# EAGLE design Control module (EAGLE 9.0.1)

## Sheet 1 of 6: Microcontroller
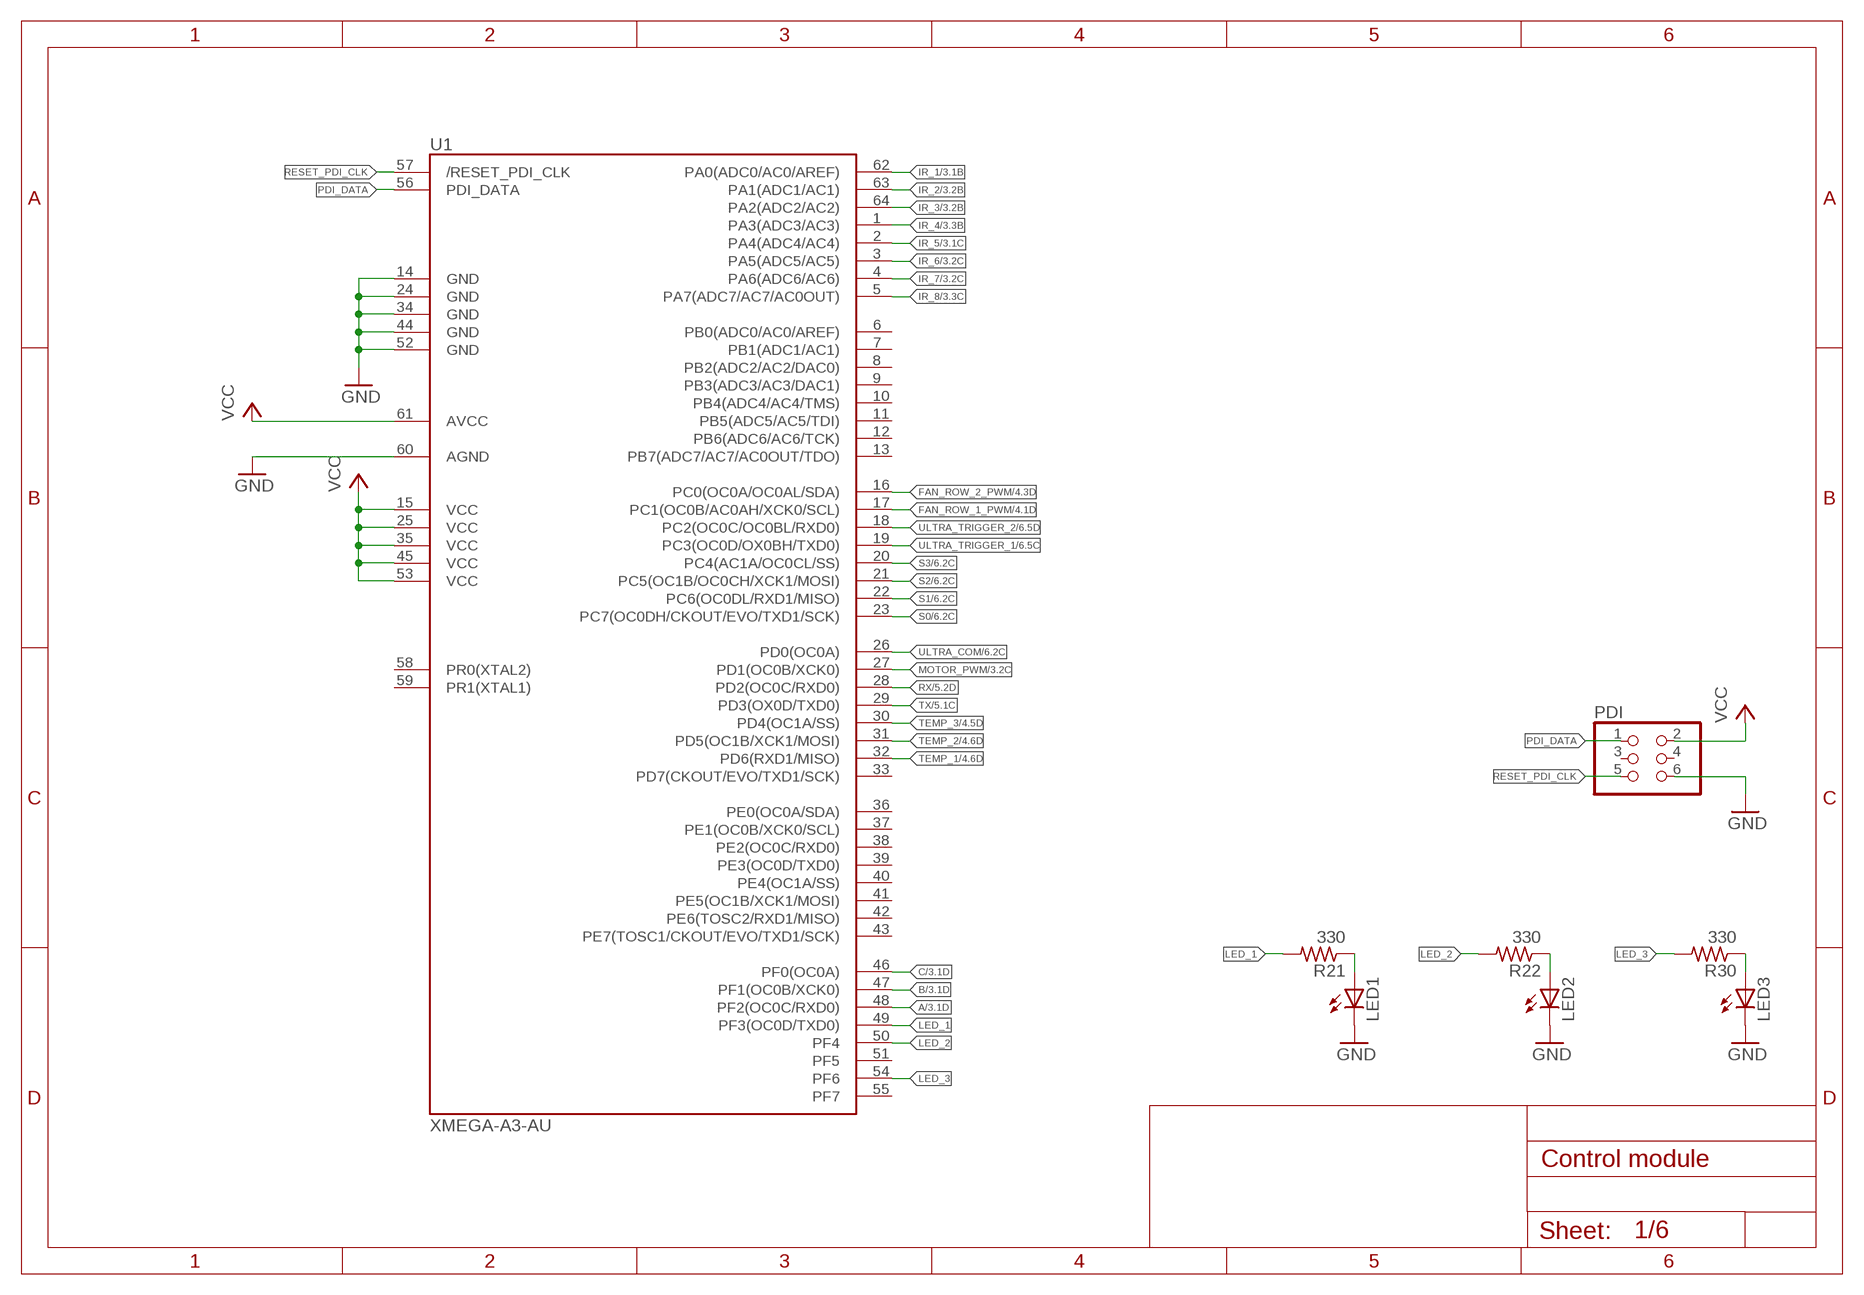
[diagram p0: schematic, sheet 1]

### Parts
LED1  LEDCHIPLED_0805  [CHIPLED_0805]
LED2  LEDCHIPLED_0805  [CHIPLED_0805]
LED3  LEDCHIPLED_0805  [CHIPLED_0805]
PDI  PINHD-2X3  [2X03]
R21  330  R-US_R0805  [R0805]
R22  330  R-US_R0805  [R0805]
R30  330  R-US_R0805  [R0805]
U1  XMEGA-A3-AU  [TQFP64_14X14MM_MCU]

### Nets
A: U1.48(PF2(OC0C/RXD0)) ; also sheet 3
B: U1.47(PF1(OC0B/XCK0)) ; also sheet 3
C: U1.46(PF0(OC0A)) ; also sheet 3
FAN_ROW_1_PWM: U1.17(PC1(OC0B/AC0AH/XCK0/SCL)) ; also sheet 4
FAN_ROW_2_PWM: U1.16(PC0(OC0A/OC0AL/SDA)) ; also sheet 4
GND: LED1.C LED2.C LED3.C PDI.6 U1.14(GND1) U1.24(GND2) U1.34(GND3) U1.44(GND4) U1.52(GND5) U1.60(AGND) ; also sheet 2,3,4,5,6
IR_1: U1.62(PA0(ADC0/AC0/AREF)) ; also sheet 3
IR_2: U1.63(PA1(ADC1/AC1)) ; also sheet 3
IR_3: U1.64(PA2(ADC2/AC2)) ; also sheet 3
IR_4: U1.1(PA3(ADC3/AC3)) ; also sheet 3
IR_5: U1.2(PA4(ADC4/AC4)) ; also sheet 3
IR_6: U1.3(PA5(ADC5/AC5)) ; also sheet 3
IR_7: U1.4(PA6(ADC6/AC6)) ; also sheet 3
IR_8: U1.5(PA7(ADC7/AC7/AC0OUT)) ; also sheet 3
LED_1: R21.2 U1.49(PF3(OC0D/TXD0))
LED_2: R22.2 U1.50(PF4)
LED_3: R30.2 U1.54(PF6)
MOTOR_PWM: U1.27(PD1(OC0B/XCK0)) ; also sheet 3
N$1: LED2.A R22.1
N$3: LED1.A R21.1
N$4: LED3.A R30.1
PDI_DATA: PDI.1 U1.56(PDI_DATA)
RESET_PDI_CLK: PDI.5 U1.57(/RESET_PDI_CLK)
RX: U1.28(PD2(OC0C/RXD0)) ; also sheet 5
S0: U1.23(PC7(OC0DH/CKOUT/EVO/TXD1/SCK)) ; also sheet 6
S1: U1.22(PC6(OC0DL/RXD1/MISO)) ; also sheet 6
S2: U1.21(PC5(OC1B/OC0CH/XCK1/MOSI)) ; also sheet 6
S3: U1.20(PC4(AC1A/OC0CL/SS)) ; also sheet 6
TEMP_1: U1.32(PD6(RXD1/MISO)) ; also sheet 4
TEMP_2: U1.31(PD5(OC1B/XCK1/MOSI)) ; also sheet 4
TEMP_3: U1.30(PD4(OC1A/SS)) ; also sheet 4
TX: U1.29(PD3(OX0D/TXD0)) ; also sheet 5
ULTRA_COM: U1.26(PD0(OC0A)) ; also sheet 6
ULTRA_TRIGGER_1: U1.19(PC3(OC0D/OX0BH/TXD0)) ; also sheet 6
ULTRA_TRIGGER_2: U1.18(PC2(OC0C/OC0BL/RXD0)) ; also sheet 6
VCC: PDI.2 U1.15(VCC1) U1.25(VCC2) U1.35(VCC3) U1.45(VCC4) U1.53(VCC5) U1.61(AVCC) ; also sheet 2,3,4,5,6
Unconnected: PDI.3 PDI.4 U1.6(PB0(ADC0/AC0/AREF)) U1.7(PB1(ADC1/AC1)) U1.8(PB2(ADC2/AC2/DAC0)) U1.9(PB3(ADC3/AC3/DAC1)) U1.10(PB4(ADC4/AC4/TMS)) U1.11(PB5(ADC5/AC5/TDI)) U1.12(PB6(ADC6/AC6/TCK)) U1.13(PB7(ADC7/AC7/AC0OUT/TDO)) U1.33(PD7(CKOUT/EVO/TXD1/SCK)) U1.36(PE0(OC0A/SDA)) U1.37(PE1(OC0B/XCK0/SCL)) U1.38(PE2(OC0C/RXD0)) U1.39(PE3(OC0D/TXD0)) U1.40(PE4(OC1A/SS)) U1.41(PE5(OC1B/XCK1/MOSI)) U1.42(PE6(TOSC2/RXD1/MISO)) U1.43(PE7(TOSC1/CKOUT/EVO/TXD1/SCK)) U1.51(PF5) U1.55(PF7) U1.58(PR0(XTAL2)) U1.59(PR1(XTAL1))

## Sheet 2 of 6: Voltage regulation
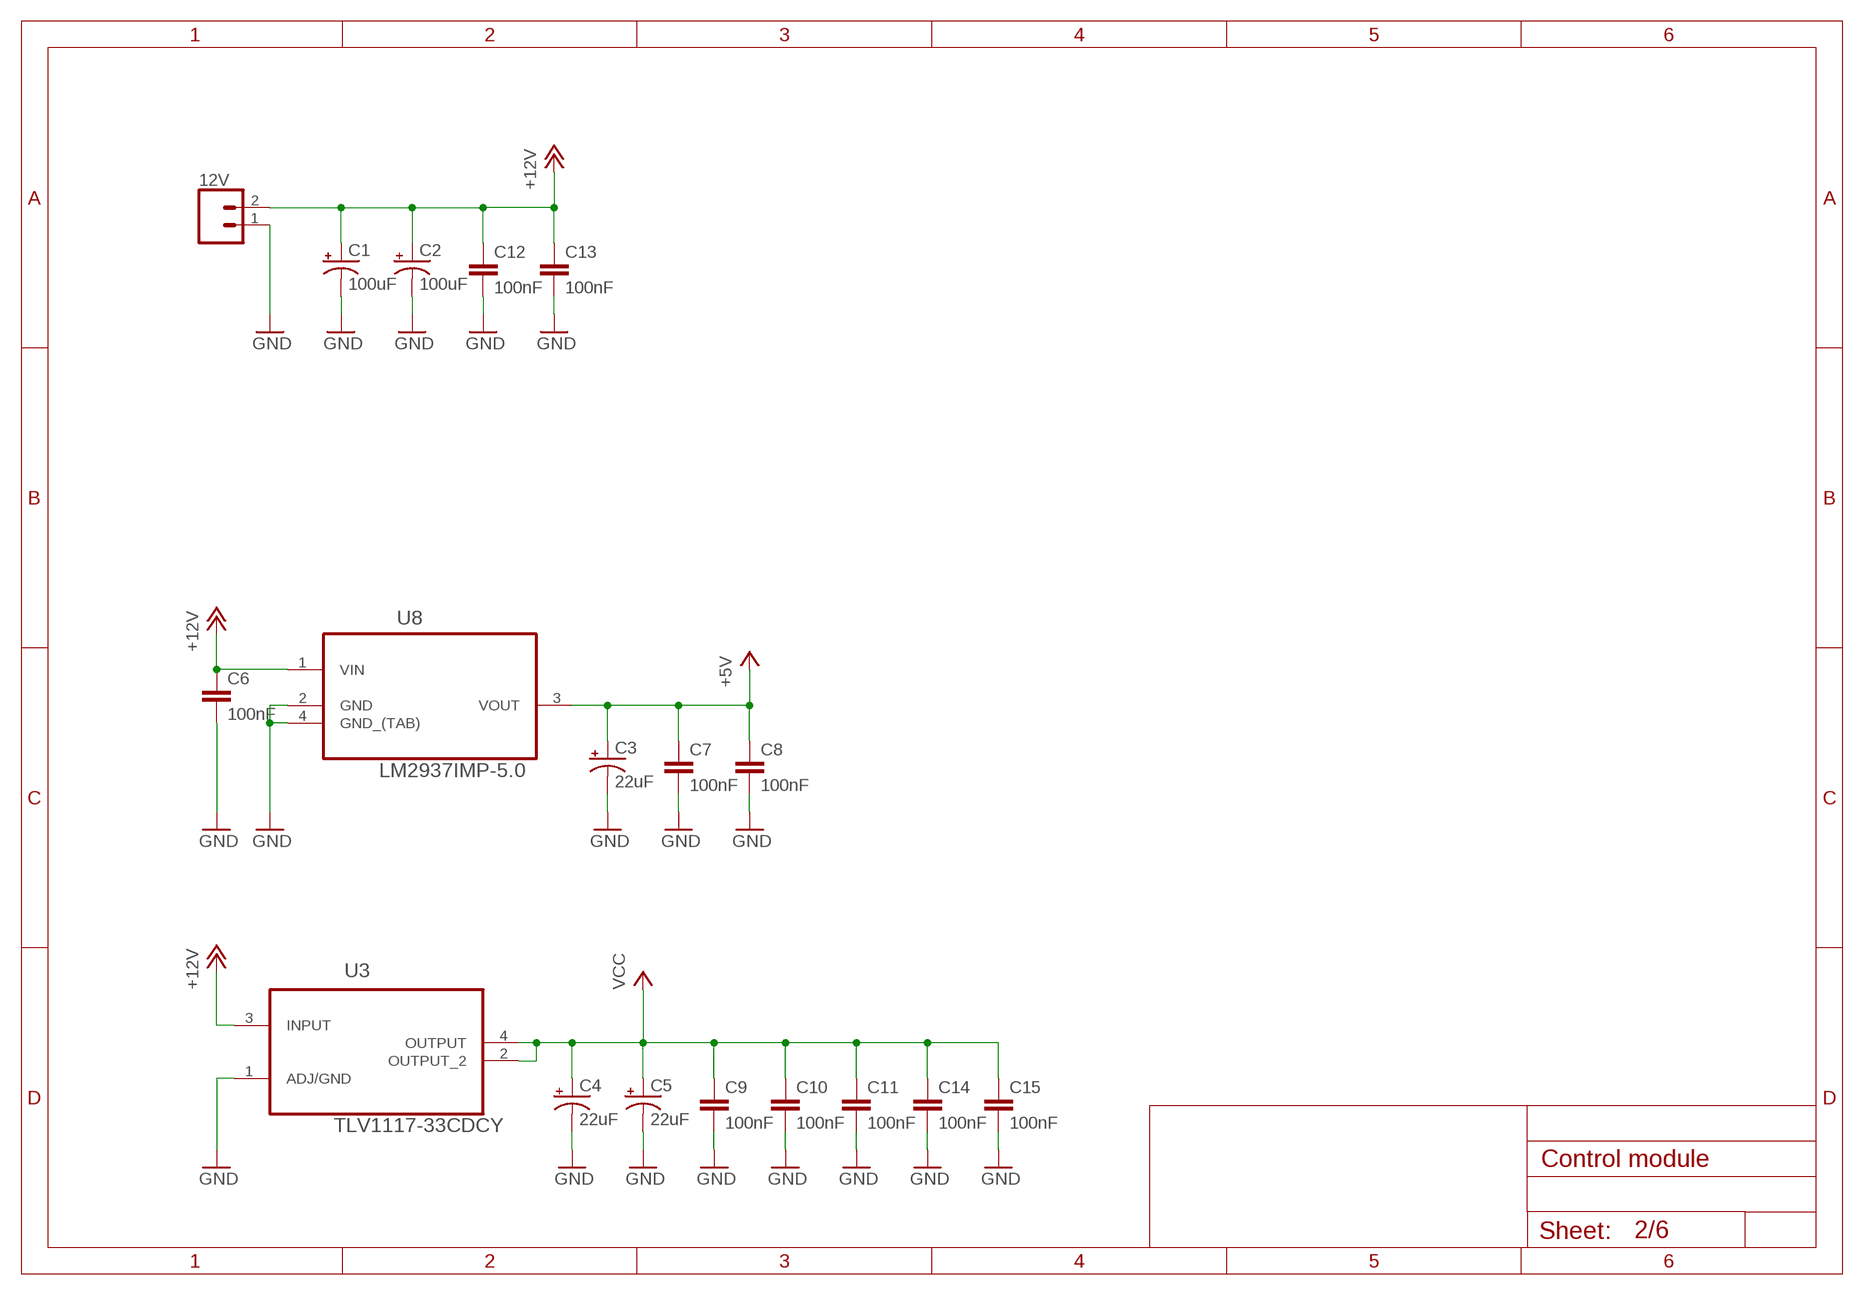
[diagram p1: schematic, sheet 2]

### Parts
12V  CONN_025MM  [SCREWTERMINAL-5MM-2]
C1  100uF  CPOL-US150CLZ-0810  [150CLZ-0810]
C2  100uF  CPOL-US150CLZ-0810  [150CLZ-0810]
C3  22uF  CPOL-US153CLV-0505  [153CLV-0505]
C4  22uF  CPOL-US153CLV-0505  [153CLV-0505]
C5  22uF  CPOL-US153CLV-0505  [153CLV-0505]
C6  100nF  1.0UF-0805-25V-(+80/-20%)  [0805]
C7  100nF  1.0UF-0805-25V-(+80/-20%)  [0805]
C8  100nF  1.0UF-0805-25V-(+80/-20%)  [0805]
C9  100nF  1.0UF-0805-25V-(+80/-20%)  [0805]
C10  100nF  1.0UF-0805-25V-(+80/-20%)  [0805]
C11  100nF  1.0UF-0805-25V-(+80/-20%)  [0805]
C12  100nF  1.0UF-0805-25V-(+80/-20%)  [0805]
C13  100nF  1.0UF-0805-25V-(+80/-20%)  [0805]
C14  100nF  1.0UF-0805-25V-(+80/-20%)  [0805]
C15  100nF  1.0UF-0805-25V-(+80/-20%)  [0805]
U3  TLV1117-33CDCY  [SOT230P700X180-4N]
U8  LM2937IMP-5.0  [SOT230P700X180-4N]

### Nets
+5V: C3.+ C7.1 C8.1 U8.3(VOUT) ; also sheet 5,6
+12V: 12V.2 C1.+ C2.+ C6.1 C12.1 C13.1 U3.3(INPUT) U8.1(VIN) ; also sheet 3,4,5
GND: 12V.1 C1.- C2.- C3.- C4.- C5.- C6.2 C7.2 C8.2 C9.2 C10.2 C11.2 C12.2 C13.2 C14.2 C15.2 U3.1(ADJ/GND) U8.2(GND) U8.4(GND_(TAB)) ; also sheet 1,3,4,5,6
VCC: C4.+ C5.+ C9.1 C10.1 C11.1 C14.1 C15.1 U3.2(OUTPUT_2) U3.4(OUTPUT) ; also sheet 1,3,4,5,6

## Sheet 3 of 6: Motor control
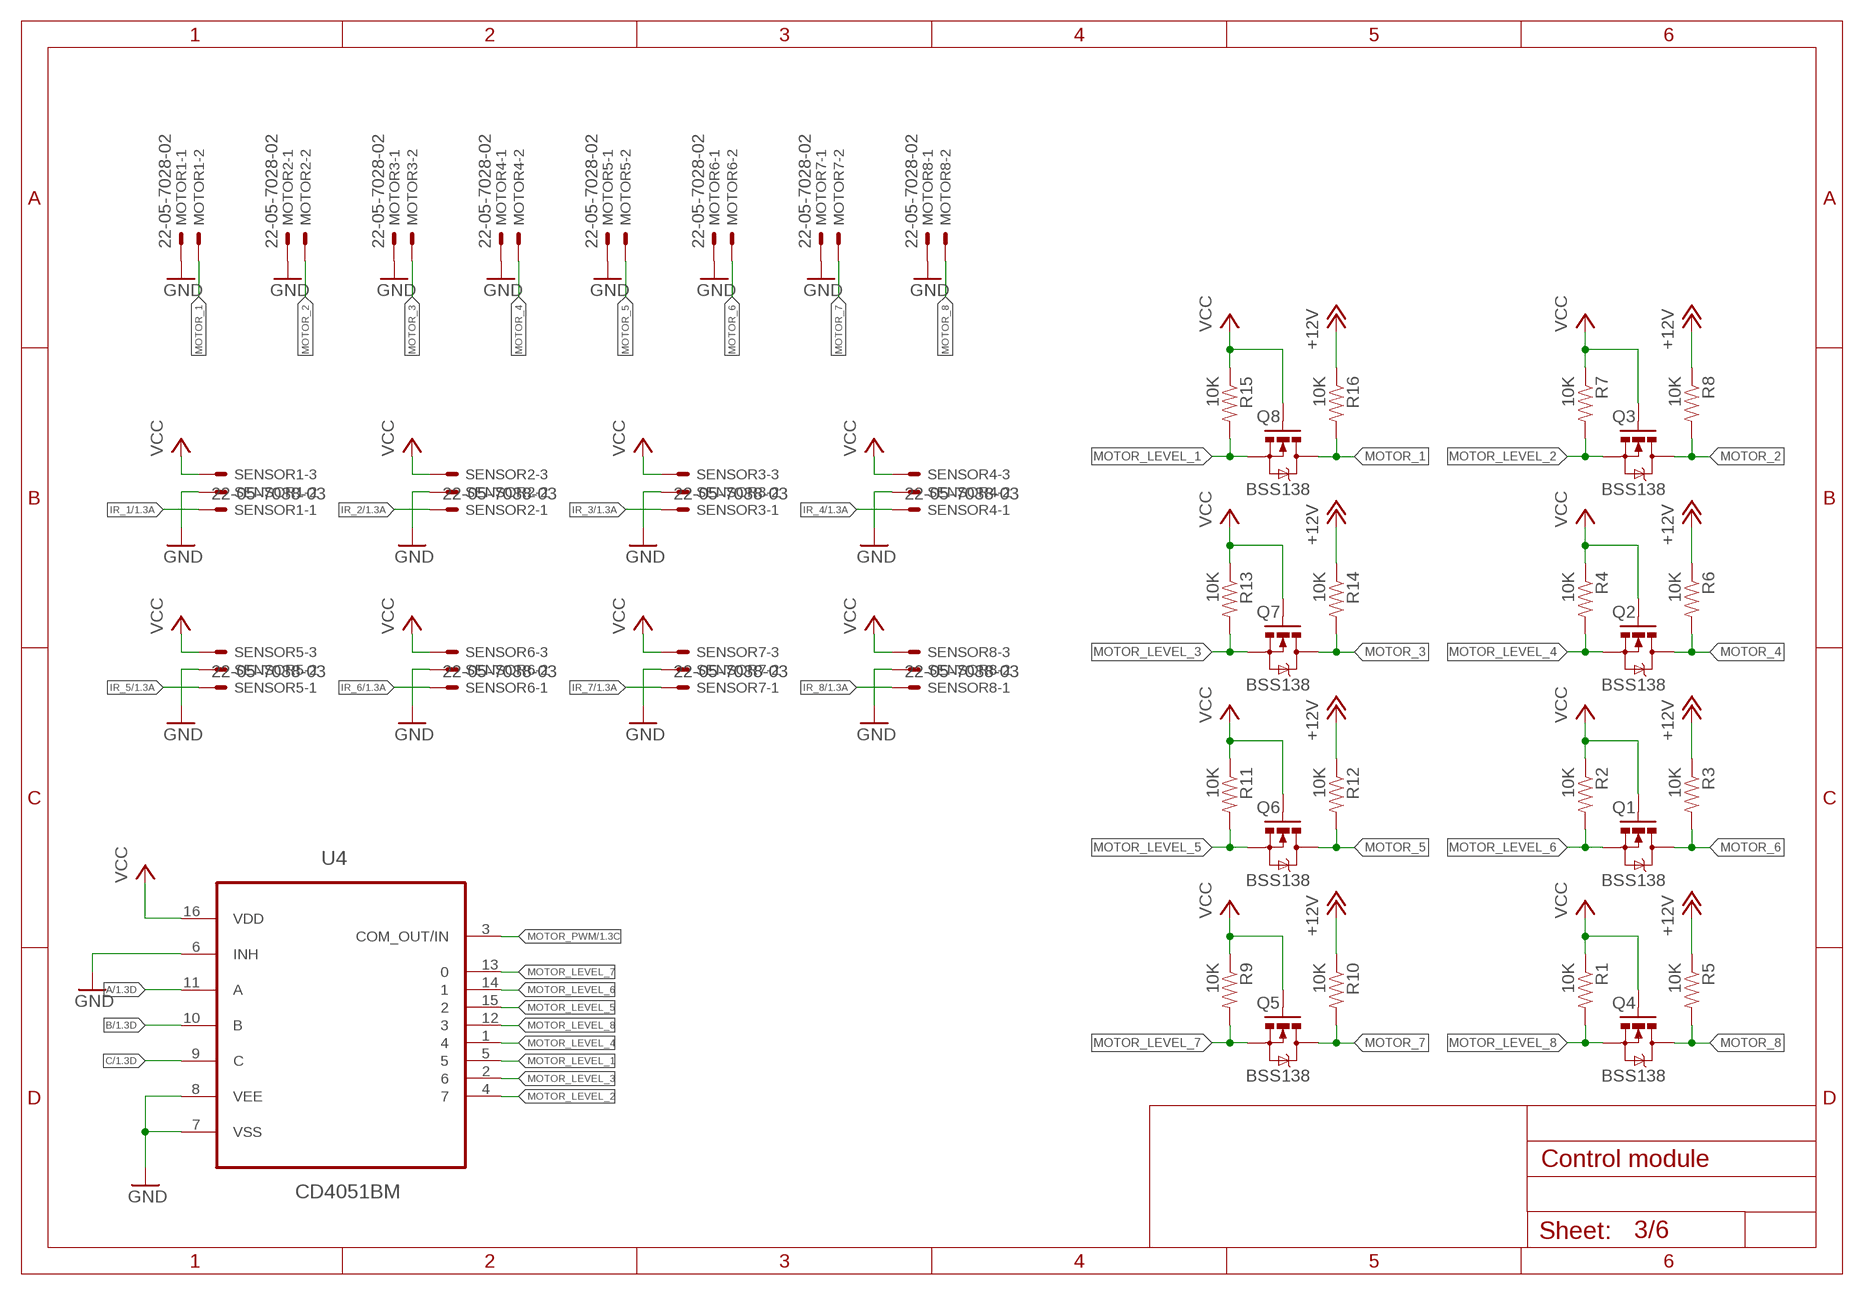
[diagram p2: schematic, sheet 3]

### Parts
MOTOR1  22-05-7028-02  [7395-02]
MOTOR2  22-05-7028-02  [7395-02]
MOTOR3  22-05-7028-02  [7395-02]
MOTOR4  22-05-7028-02  [7395-02]
MOTOR5  22-05-7028-02  [7395-02]
MOTOR6  22-05-7028-02  [7395-02]
MOTOR7  22-05-7028-02  [7395-02]
MOTOR8  22-05-7028-02  [7395-02]
Q1  BSS138  MOSFET-NCHANNELSMD  [SOT23-3]
Q2  BSS138  MOSFET-NCHANNELSMD  [SOT23-3]
Q3  BSS138  MOSFET-NCHANNELSMD  [SOT23-3]
Q4  BSS138  MOSFET-NCHANNELSMD  [SOT23-3]
Q5  BSS138  MOSFET-NCHANNELSMD  [SOT23-3]
Q6  BSS138  MOSFET-NCHANNELSMD  [SOT23-3]
Q7  BSS138  MOSFET-NCHANNELSMD  [SOT23-3]
Q8  BSS138  MOSFET-NCHANNELSMD  [SOT23-3]
R1  10K  RESISTOR0603-RES  [0603-RES]
R2  10K  RESISTOR0603-RES  [0603-RES]
R3  10K  RESISTOR0603-RES  [0603-RES]
R4  10K  RESISTOR0603-RES  [0603-RES]
R5  10K  RESISTOR0603-RES  [0603-RES]
R6  10K  RESISTOR0603-RES  [0603-RES]
R7  10K  RESISTOR0603-RES  [0603-RES]
R8  10K  RESISTOR0603-RES  [0603-RES]
R9  10K  RESISTOR0603-RES  [0603-RES]
R10  10K  RESISTOR0603-RES  [0603-RES]
R11  10K  RESISTOR0603-RES  [0603-RES]
R12  10K  RESISTOR0603-RES  [0603-RES]
R13  10K  RESISTOR0603-RES  [0603-RES]
R14  10K  RESISTOR0603-RES  [0603-RES]
R15  10K  RESISTOR0603-RES  [0603-RES]
R16  10K  RESISTOR0603-RES  [0603-RES]
SENSOR1  22-05-7038-03  [7395-03]
SENSOR2  22-05-7038-03  [7395-03]
SENSOR3  22-05-7038-03  [7395-03]
SENSOR4  22-05-7038-03  [7395-03]
SENSOR5  22-05-7038-03  [7395-03]
SENSOR6  22-05-7038-03  [7395-03]
SENSOR7  22-05-7038-03  [7395-03]
SENSOR8  22-05-7038-03  [7395-03]
U4  CD4051BM  [SOIC127P600X175-16N]

### Nets
+12V: R3.1 R5.1 R6.1 R8.1 R10.1 R12.1 R14.1 R16.1 ; also sheet 2,4,5
A: U4.11(A) ; also sheet 1
B: U4.10(B) ; also sheet 1
C: U4.9(C) ; also sheet 1
GND: MOTOR1.1 MOTOR2.1 MOTOR3.1 MOTOR4.1 MOTOR5.1 MOTOR6.1 MOTOR7.1 MOTOR8.1 SENSOR1.2 SENSOR2.2 SENSOR3.2 SENSOR4.2 SENSOR5.2 SENSOR6.2 SENSOR7.2 SENSOR8.2 U4.6(INH) U4.7(VSS) U4.8(VEE) ; also sheet 1,2,4,5,6
IR_1: SENSOR1.1 ; also sheet 1
IR_2: SENSOR2.1 ; also sheet 1
IR_3: SENSOR3.1 ; also sheet 1
IR_4: SENSOR4.1 ; also sheet 1
IR_5: SENSOR5.1 ; also sheet 1
IR_6: SENSOR6.1 ; also sheet 1
IR_7: SENSOR7.1 ; also sheet 1
IR_8: SENSOR8.1 ; also sheet 1
MOTOR_1: MOTOR1.2 Q8.3(D) R16.2
MOTOR_2: MOTOR2.2 Q3.3(D) R8.2
MOTOR_3: MOTOR3.2 Q7.3(D) R14.2
MOTOR_4: MOTOR4.2 Q2.3(D) R6.2
MOTOR_5: MOTOR5.2 Q6.3(D) R12.2
MOTOR_6: MOTOR6.2 Q1.3(D) R3.2
MOTOR_7: MOTOR7.2 Q5.3(D) R10.2
MOTOR_8: MOTOR8.2 Q4.3(D) R5.2
MOTOR_LEVEL_1: Q8.2(S) R15.2 U4.5
MOTOR_LEVEL_2: Q3.2(S) R7.2 U4.4
MOTOR_LEVEL_3: Q7.2(S) R13.2 U4.2
MOTOR_LEVEL_4: Q2.2(S) R4.2 U4.1
MOTOR_LEVEL_5: Q6.2(S) R11.2 U4.15
MOTOR_LEVEL_6: Q1.2(S) R2.2 U4.14
MOTOR_LEVEL_7: Q5.2(S) R9.2 U4.13
MOTOR_LEVEL_8: Q4.2(S) R1.2 U4.12
MOTOR_PWM: U4.3(COM_OUT/IN) ; also sheet 1
VCC: Q1.1(G) Q2.1(G) Q3.1(G) Q4.1(G) Q5.1(G) Q6.1(G) Q7.1(G) Q8.1(G) R1.1 R2.1 R4.1 R7.1 R9.1 R11.1 R13.1 R15.1 SENSOR1.3 SENSOR2.3 SENSOR3.3 SENSOR4.3 SENSOR5.3 SENSOR6.3 SENSOR7.3 SENSOR8.3 U4.16(VDD) ; also sheet 1,2,4,5,6

## Sheet 4 of 6: Fan control
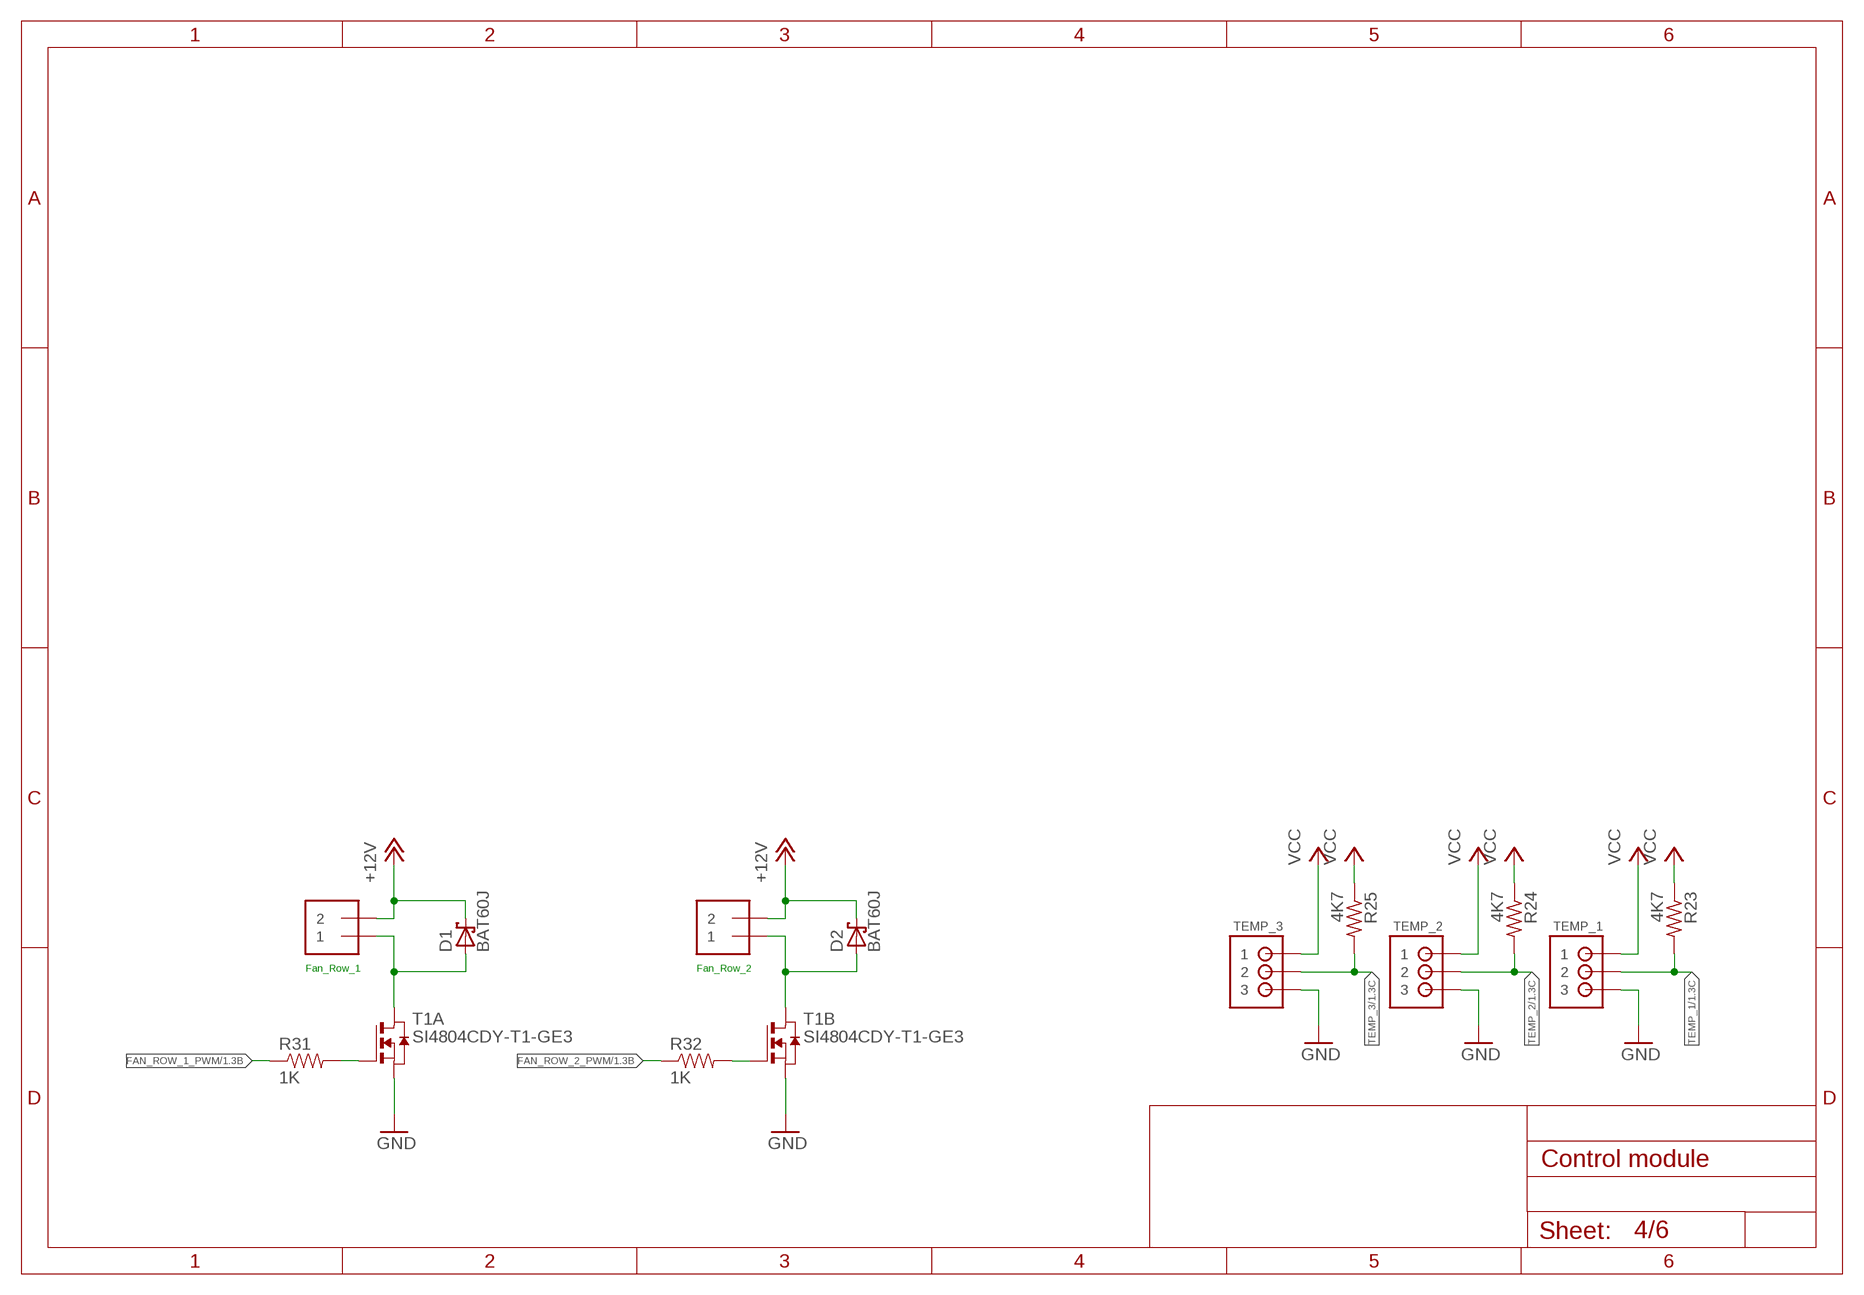
[diagram p3: schematic, sheet 4]

### Parts
D1  BAT60J  [SOD323_ST]
D2  BAT60J  [SOD323_ST]
FAN_1  1X2-3.5MM  [1X2-3.5MM]
FAN_2  1X2-3.5MM  [1X2-3.5MM]
R23  4K7  R-US_R0805  [R0805]
R24  4K7  R-US_R0805  [R0805]
R25  4K7  R-US_R0805  [R0805]
R31  1K  RESISTOR0603-RES  [0603-RES]
R32  1K  RESISTOR0603-RES  [0603-RES]
T1  SI4804CDY-T1-GE3  DMN3024LSD  [SO8]
TEMP_1  JST-PH_3-PIN_HEADER  [JST_B3B-PH_HEADER]
TEMP_2  JST-PH_3-PIN_HEADER  [JST_B3B-PH_HEADER]
TEMP_3  JST-PH_3-PIN_HEADER  [JST_B3B-PH_HEADER]

### Nets
+12V: D1.C D2.C FAN_1.2 FAN_2.2 ; also sheet 2,3,5
FAN_ROW_1_PWM: R31.1 ; also sheet 1
FAN_ROW_2_PWM: R32.1 ; also sheet 1
GND: T1.1(A:S) T1.3(B:S) TEMP_1.P3 TEMP_2.P3 TEMP_3.P3 ; also sheet 1,2,3,5,6
N$2: R31.2 T1.2(A:G)
N$5: D2.A FAN_2.1 T1.5(B:D) T1.6(B:D)
N$6: R32.2 T1.4(B:G)
N$7: D1.A FAN_1.1 T1.7(A:D) T1.8(A:D)
TEMP_1: R23.2 TEMP_1.P2 ; also sheet 1
TEMP_2: R24.2 TEMP_2.P2 ; also sheet 1
TEMP_3: R25.2 TEMP_3.P2 ; also sheet 1
VCC: R23.1 R24.1 R25.1 TEMP_1.P1 TEMP_2.P1 TEMP_3.P1 ; also sheet 1,2,3,5,6

### Notes on the sheet
- Fan_Row_1 | Fan_Row_2

## Sheet 5 of 6: Communication
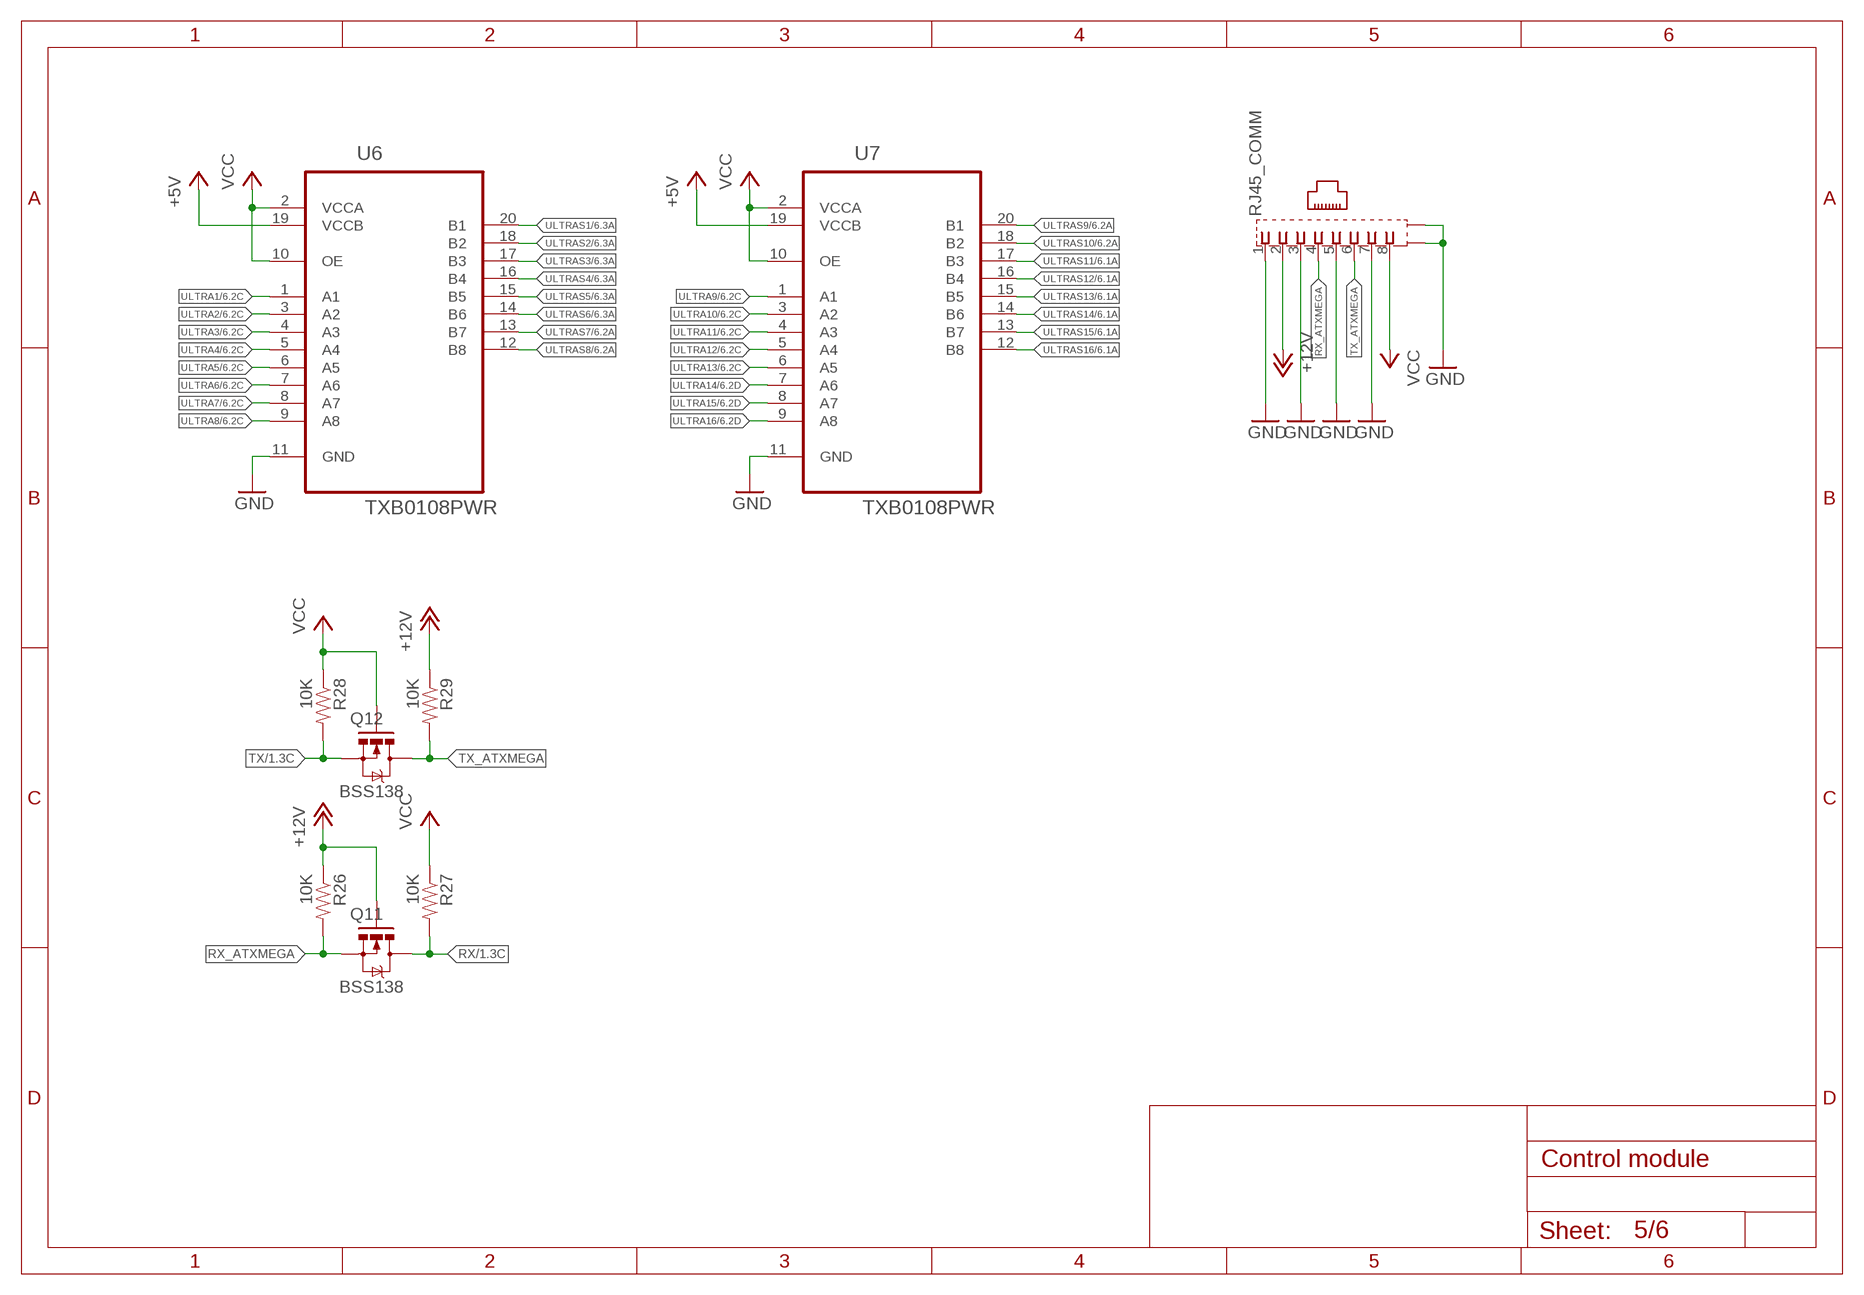
[diagram p4: schematic, sheet 5]

### Parts
Q11  BSS138  MOSFET-NCHANNELSMD  [SOT23-3]
Q12  BSS138  MOSFET-NCHANNELSMD  [SOT23-3]
R26  10K  RESISTOR0603-RES  [0603-RES]
R27  10K  RESISTOR0603-RES  [0603-RES]
R28  10K  RESISTOR0603-RES  [0603-RES]
R29  10K  RESISTOR0603-RES  [0603-RES]
RJ45_COMM  0446200002  [0446200002]
U6  TXB0108PWR  [SOP65P640X120-20N]
U7  TXB0108PWR  [SOP65P640X120-20N]

### Nets
+5V: U6.19(VCCB) U7.19(VCCB) ; also sheet 2,6
+12V: Q11.1(G) R26.1 R29.1 RJ45_COMM.2 ; also sheet 2,3,4
GND: RJ45_COMM.1 RJ45_COMM.3 RJ45_COMM.5 RJ45_COMM.7 RJ45_COMM.S@1(S1) RJ45_COMM.S@2(S2) U6.11(GND) U7.11(GND) ; also sheet 1,2,3,4,6
RX: Q11.3(D) R27.2 ; also sheet 1
RX_ATXMEGA: Q11.2(S) R26.2 RJ45_COMM.4
TX: Q12.2(S) R28.2 ; also sheet 1
TX_ATXMEGA: Q12.3(D) R29.2 RJ45_COMM.6
ULTRA1: U6.1(A1) ; also sheet 6
ULTRA2: U6.3(A2) ; also sheet 6
ULTRA3: U6.4(A3) ; also sheet 6
ULTRA4: U6.5(A4) ; also sheet 6
ULTRA5: U6.6(A5) ; also sheet 6
ULTRA6: U6.7(A6) ; also sheet 6
ULTRA7: U6.8(A7) ; also sheet 6
ULTRA8: U6.9(A8) ; also sheet 6
ULTRA9: U7.1(A1) ; also sheet 6
ULTRA10: U7.3(A2) ; also sheet 6
ULTRA11: U7.4(A3) ; also sheet 6
ULTRA12: U7.5(A4) ; also sheet 6
ULTRA13: U7.6(A5) ; also sheet 6
ULTRA14: U7.7(A6) ; also sheet 6
ULTRA15: U7.8(A7) ; also sheet 6
ULTRA16: U7.9(A8) ; also sheet 6
ULTRAS1: U6.20(B1) ; also sheet 6
ULTRAS2: U6.18(B2) ; also sheet 6
ULTRAS3: U6.17(B3) ; also sheet 6
ULTRAS4: U6.16(B4) ; also sheet 6
ULTRAS5: U6.15(B5) ; also sheet 6
ULTRAS6: U6.14(B6) ; also sheet 6
ULTRAS7: U6.13(B7) ; also sheet 6
ULTRAS8: U6.12(B8) ; also sheet 6
ULTRAS9: U7.20(B1) ; also sheet 6
ULTRAS10: U7.18(B2) ; also sheet 6
ULTRAS11: U7.17(B3) ; also sheet 6
ULTRAS12: U7.16(B4) ; also sheet 6
ULTRAS13: U7.15(B5) ; also sheet 6
ULTRAS14: U7.14(B6) ; also sheet 6
ULTRAS15: U7.13(B7) ; also sheet 6
ULTRAS16: U7.12(B8) ; also sheet 6
VCC: Q12.1(G) R27.1 R28.1 RJ45_COMM.8 U6.2(VCCA) U6.10(OE) U7.2(VCCA) U7.10(OE) ; also sheet 1,2,3,4,6

## Sheet 6 of 6: Distance sensors
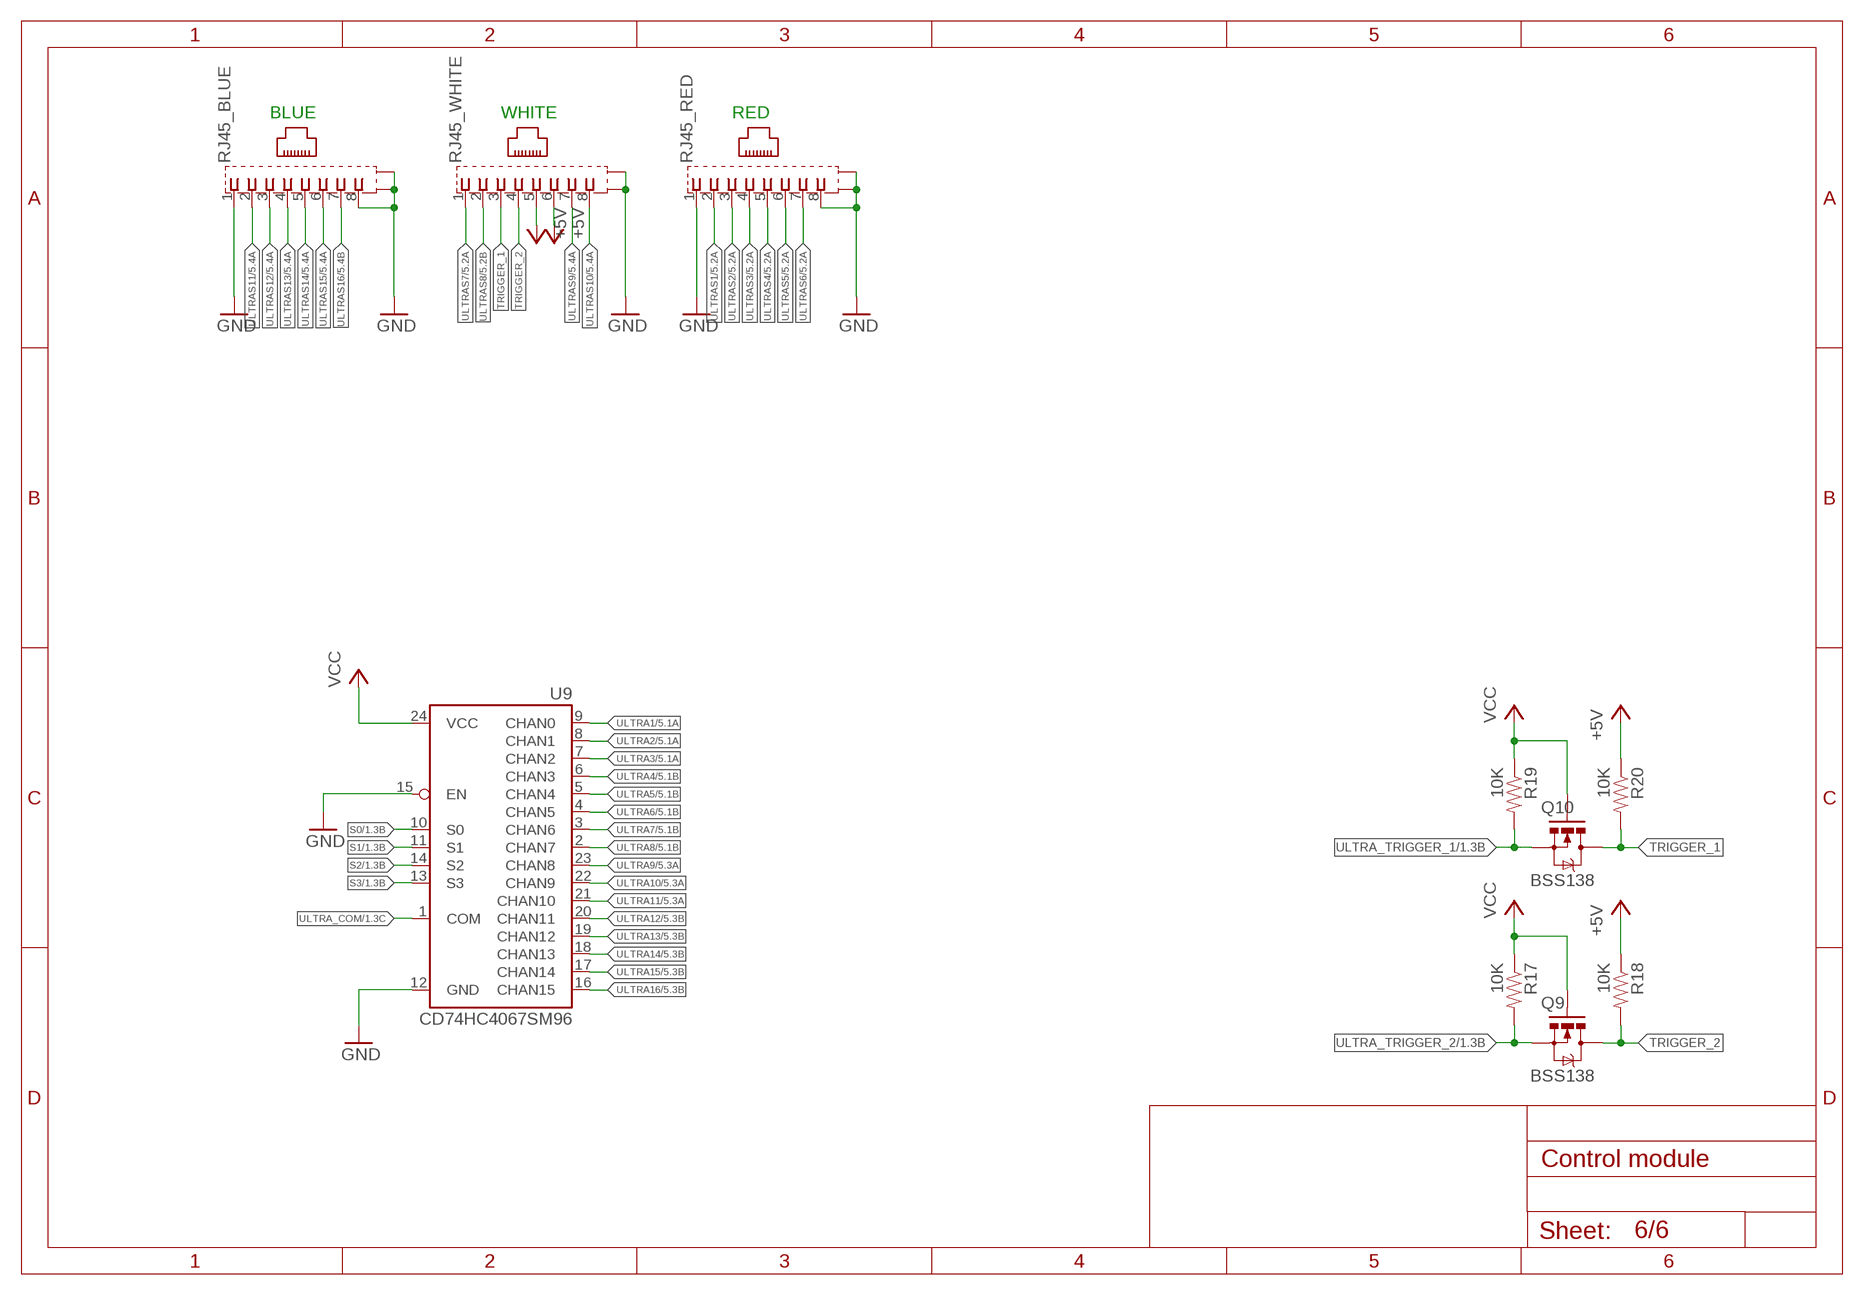
[diagram p5: schematic, sheet 6]

### Parts
Q9  BSS138  MOSFET-NCHANNELSMD  [SOT23-3]
Q10  BSS138  MOSFET-NCHANNELSMD  [SOT23-3]
R17  10K  RESISTOR0603-RES  [0603-RES]
R18  10K  RESISTOR0603-RES  [0603-RES]
R19  10K  RESISTOR0603-RES  [0603-RES]
R20  10K  RESISTOR0603-RES  [0603-RES]
RJ45_BLUE  0446200002  [0446200002]
RJ45_RED  0446200002  [0446200002]
RJ45_WHITE  0446200002  [0446200002]
U9  CD74HC4067SM96  74HC4067SM96  [SSOP24]

### Nets
+5V: R18.1 R20.1 RJ45_WHITE.5 RJ45_WHITE.6 ; also sheet 2,5
GND: RJ45_BLUE.1 RJ45_BLUE.8 RJ45_BLUE.S@1(S1) RJ45_BLUE.S@2(S2) RJ45_RED.1 RJ45_RED.8 RJ45_RED.S@1(S1) RJ45_RED.S@2(S2) RJ45_WHITE.S@1(S1) RJ45_WHITE.S@2(S2) U9.12(GND) U9.15(EN) ; also sheet 1,2,3,4,5
S0: U9.10(S0) ; also sheet 1
S1: U9.11(S1) ; also sheet 1
S2: U9.14(S2) ; also sheet 1
S3: U9.13(S3) ; also sheet 1
TRIGGER_1: Q10.3(D) R20.2 RJ45_WHITE.3
TRIGGER_2: Q9.3(D) R18.2 RJ45_WHITE.4
ULTRA1: U9.9(CHAN0) ; also sheet 5
ULTRA2: U9.8(CHAN1) ; also sheet 5
ULTRA3: U9.7(CHAN2) ; also sheet 5
ULTRA4: U9.6(CHAN3) ; also sheet 5
ULTRA5: U9.5(CHAN4) ; also sheet 5
ULTRA6: U9.4(CHAN5) ; also sheet 5
ULTRA7: U9.3(CHAN6) ; also sheet 5
ULTRA8: U9.2(CHAN7) ; also sheet 5
ULTRA9: U9.23(CHAN8) ; also sheet 5
ULTRA10: U9.22(CHAN9) ; also sheet 5
ULTRA11: U9.21(CHAN10) ; also sheet 5
ULTRA12: U9.20(CHAN11) ; also sheet 5
ULTRA13: U9.19(CHAN12) ; also sheet 5
ULTRA14: U9.18(CHAN13) ; also sheet 5
ULTRA15: U9.17(CHAN14) ; also sheet 5
ULTRA16: U9.16(CHAN15) ; also sheet 5
ULTRA_COM: U9.1(COM) ; also sheet 1
ULTRA_TRIGGER_1: Q10.2(S) R19.2 ; also sheet 1
ULTRA_TRIGGER_2: Q9.2(S) R17.2 ; also sheet 1
ULTRAS1: RJ45_RED.2 ; also sheet 5
ULTRAS2: RJ45_RED.3 ; also sheet 5
ULTRAS3: RJ45_RED.4 ; also sheet 5
ULTRAS4: RJ45_RED.5 ; also sheet 5
ULTRAS5: RJ45_RED.6 ; also sheet 5
ULTRAS6: RJ45_RED.7 ; also sheet 5
ULTRAS7: RJ45_WHITE.1 ; also sheet 5
ULTRAS8: RJ45_WHITE.2 ; also sheet 5
ULTRAS9: RJ45_WHITE.7 ; also sheet 5
ULTRAS10: RJ45_WHITE.8 ; also sheet 5
ULTRAS11: RJ45_BLUE.2 ; also sheet 5
ULTRAS12: RJ45_BLUE.3 ; also sheet 5
ULTRAS13: RJ45_BLUE.4 ; also sheet 5
ULTRAS14: RJ45_BLUE.5 ; also sheet 5
ULTRAS15: RJ45_BLUE.6 ; also sheet 5
ULTRAS16: RJ45_BLUE.7 ; also sheet 5
VCC: Q9.1(G) Q10.1(G) R17.1 R19.1 U9.24(VCC) ; also sheet 1,2,3,4,5

### Notes on the sheet
- BLUE | WHITE | RED

## Library data of the parts
12V = SparkFun-Connectors:CONN_02: Multi connection point. Often used as Generic Header-pin footprint for 0.1 inch spaced/style header connections On any of the 0.1 inch spaced packages, you can populate with these: Break Away Headers - Straight <https://www.sparkfun.com/products/116> (PRT-00116) Break Away Male Headers - Right Angle <https://www.sparkfun.com/products/553> (PRT-00553) Female Headers <https://www.sparkfun.com/products/115> (PRT-00115) Break Away Headers - Machine Pin <https://www.sparkfun.com/products/117> (PRT-00117) Break Away Female Headers - Swiss Machine Pin <https://www.sparkfun.com/products/743> (PRT-00743) For SCREWTERMINALS and SPRING TERMINALS visit here: Screw Terimnals on SparkFun.com <https://www.sparkfun.com/search/results?term=Screw+Terminals> (5mm/3.5mm/2.54mm spacing) This device is also useful as a general connection point to wire up your design to another part of your project. Our various solder wires solder well into these plated through hole pads. Hook-Up Wire - Assortment (Stranded, 22 AWG) <https://www.sparkfun.com/products/11375> (PRT-11375) Hook-Up Wire - Assortment (Solid Core, 22 AWG) <https://www.sparkfun.com/products/11367> (PRT-11367) View the entire wire category on our website here <https://www.sparkfun.com/categories/141> Special notes: Molex polarized connector foot print use with: PRT-08233 with associated crimp pins and housings. 2.54_SCREWTERM for use with PRT-10571. 3.5mm Screw Terminal footprints for PRT-08084 5mm Screw Terminal footprints for use with PRT-08432; SF_SKU: PRT-08432
C1-C5 = adafruit:CPOL-US: POLARIZED CAPACITOR, American symbol
C6-C15 = SparkFun-Capacitors:1.0UF: 1µF ceramic capacitors A capacitor is a passive two-terminal electrical component used to store electrical energy temporarily in an electric field.; PROD_ID: CAP-11625; VALUE: 1.0uF
D1 D2 = diode:BAT60J: Schottky barrier diode Source: www.st.com, BAT60J.pdf
FAN_1 FAN_2 = adafruit:1X2: 3.5mm Terminal block http://www.ladyada.net/library/pcb/eaglelibrary.html
LED1-LED3 = adafruit:LED: LED OSRAM: - CHIPLED LG R971, LG N971, LY N971, LG Q971, LY Q971, LO R971, LY R971 LH N974, LH R974 LS Q976, LO Q976, LY Q976 LO Q996 - Hyper CHIPLED LW Q18S LB Q993, LB Q99A, LB R99A - SideLED LS A670, LO A670, LY A670, LG A670, LP A670 LB A673, LV A673, LT A673, LW A673 LH A674 LY A675 LS A676, LA A676, LO A676, LY A676, LW A676 LS A679, LY A679, LG A679 - Hyper Micro SIDELED® LS Y876, LA Y876, LO Y876, LY Y876 LT Y87S - SmartLED LW L88C, LW L88S LB L89C, LB L89S, LG L890 LS L89K, LO L89K, LY L89K LS L896, LA L896, LO L896, LY L896 - TOPLED LS T670, LO T670, LY T670, LG T670, LP T670 LSG T670, LSP T670, LSY T670, LOP T670, LYG T670 LG T671, LOG T671, LSG T671 LB T673, LV T673, LT T673, LW T673 LH T674 LS T676, LA T676, LO T676, LY T676, LB T676, LH T676, LSB T676, LW T676 LB T67C, LV T67C, LT T67C, LS T67K, LO T67K, LY T67K, LW E67C LS E67B, LA E67B, LO E67B, LY E67B, LB E67C, LV E67C, LT E67C LW T67C LS T679, LY T679, LG T679 LS T770, LO T770, LY T770, LG T770, LP T770 LB T773, LV T773, LT T773, LW T773 LH T774 LS E675, LA E675, LY E675, LS T675 LS T776, LA T776, LO T776, LY T776, LB T776 LHGB T686 LT T68C, LB T68C - Hyper Mini TOPLED® LB M676 - Mini TOPLED Santana® LG M470 LS M47K, LO M47K, LY M47K Source: http://www.osram.convergy.de/
MOTOR1-MOTOR8 = con-molex:22-?-02: CONNECTOR wire to board 2.54 mm (.1 inch) pitch header; MF: MOLEX; OC_FARNELL: 9731601; OC_NEWARK: unknown
PDI = pinhead:PINHD-2X3: PIN HEADER
Q1-Q12 = SparkFun:MOSFET-NCHANNEL
R1-R20 R26-R29 R31 R32 = SparkFun:RESISTOR: Resistor Basic schematic elements and footprints for 0603, 1206, and PTH resistors.
R21-R25 R30 = adafruit:R-US_: RESISTOR, American symbol
RJ45_BLUE RJ45_COMM RJ45_RED RJ45_WHITE = con-molex:0446200002: RJ-45 INVERTED MODULAR JACK ASSEMBLY WITH RJ-11 KEEPOUT FEATURE Source: Data sheet <http://www.farnell.com/datasheets/73207.pdf> MOLEX 0446200002 BUCHSE, RJ45, GESCHIRMT Source: Farnell <http://de.farnell.com/molex/0446200002/buchse-rj45-geschirmt/dp/9251910?ost=9251910>; MF: MOLEX; MPN: 0446200002; OC_FARNELL: 9251910
SENSOR1-SENSOR8 = con-molex:22-?-03: CONNECTOR wire to board 2.54 mm (.1 inch) pitch header; MF: MOLEX; OC_FARNELL: unknown; OC_NEWARK: unknown
T1 = zetex:DMN3024LSD: 30V DUAL N-CHANNEL ENHANCEMENT MODE MOSFET Source: Data sheet <http://www.diodes.com/datasheets/DMN3024LSD.pdf>; OC_FARNELL: unknown; OC_NEWARK: unknown
TEMP_1-TEMP_3 = SRG:JST-PH_3-PIN_HEADER: 3-pin JST PH Shrouded Header, top entry P/N B3B-PH-K-S Mating connector PHR-3
U1 = SparkFun-Retired:XMEGA-A3: Atmel's 8/16-bit AVR XMEGA A3 Microcontroller - ATxmega256A3, etc. Retired: IC-09806 - ATXMEGA256A3 Retired: IC-09429 - ATXMEGA128A1
U3 = Texas Instruments_By_element14_Batch_1:TLV1117-33CDCY: V REG, LDO, 3.3V, 0.8A; MPN: TLV1117-33CDCY; OC_FARNELL: 1494942; OC_NEWARK: 67K8520; PACKAGE: SOT-223-3; SUPPLIER: TEXAS INSTRUMENTS
U4 = Texas Instruments_By_element14_Batch_1:CD4051BM: CMOS Analog Multiplexers/Demultiplexers with Logic Level Conversion; MPN: CD4051BM; OC_FARNELL: 8388970; OC_NEWARK: 05B5595; PACKAGE: SOIC-16; SUPPLIER: Texas Instruments
U6 U7 = Texas Instruments_By_element14_Batch_1:TXB0108PWR: 8-BIT BIDIRECTIONAL VOLTAGE-LEVEL TRANSLATOR; MPN: TXB0108PWR; OC_FARNELL: 1494945; OC_NEWARK: 27M1151; PACKAGE: TSSOP-20; SUPPLIER: Texas Instruments
U8 = NSC_By_element14_Batch_1.1:LM2937IMP-5.0: IC, LDO VOLT REG, 5V, 0.5A; MPN: LM2937IMP-5.0; OC_FARNELL: 1798318; OC_NEWARK: 83F3856; PACKAGE: SOT-223-3; SUPPLIER: Microchip
U9 = SparkFun-IC-Logic:74*4067: 16-channel analog MUX Datasheet <http://www.sparkfun.com/datasheets/IC/cd74hc4067.pdf> SparkFun Products MP3 Trigger <https://www.sparkfun.com/products/13720> (WIG-13720) SparkFun Analog/Digital MUX Breakout - CD74HC4067 <https://www.sparkfun.com/products/9056> (BOB-09056); PROD_ID: IC-08252

## Board
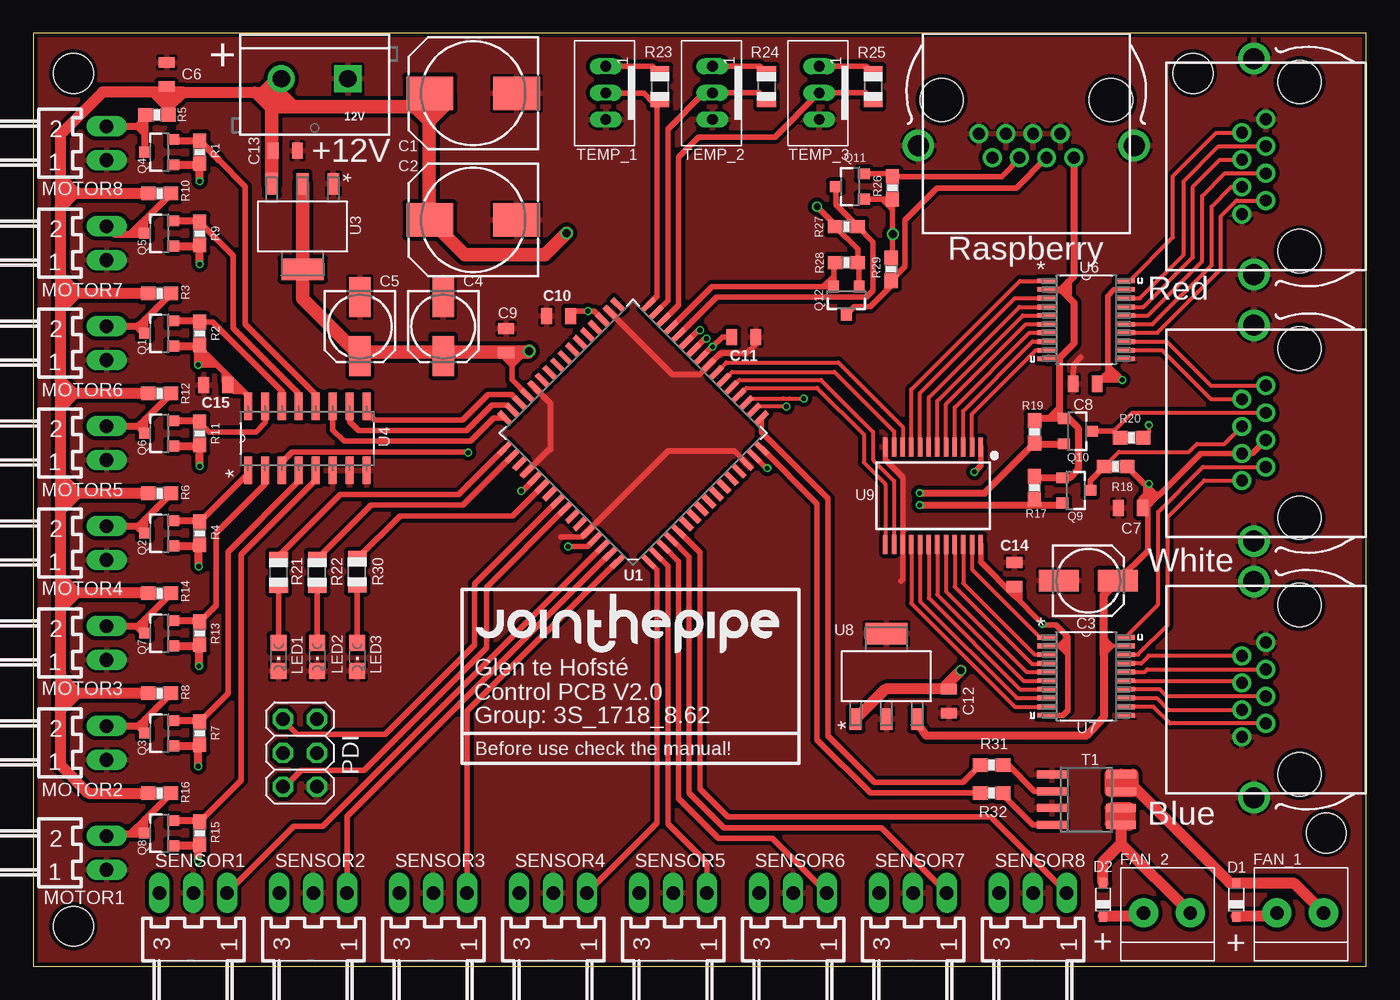
[diagram p6: board, top side]
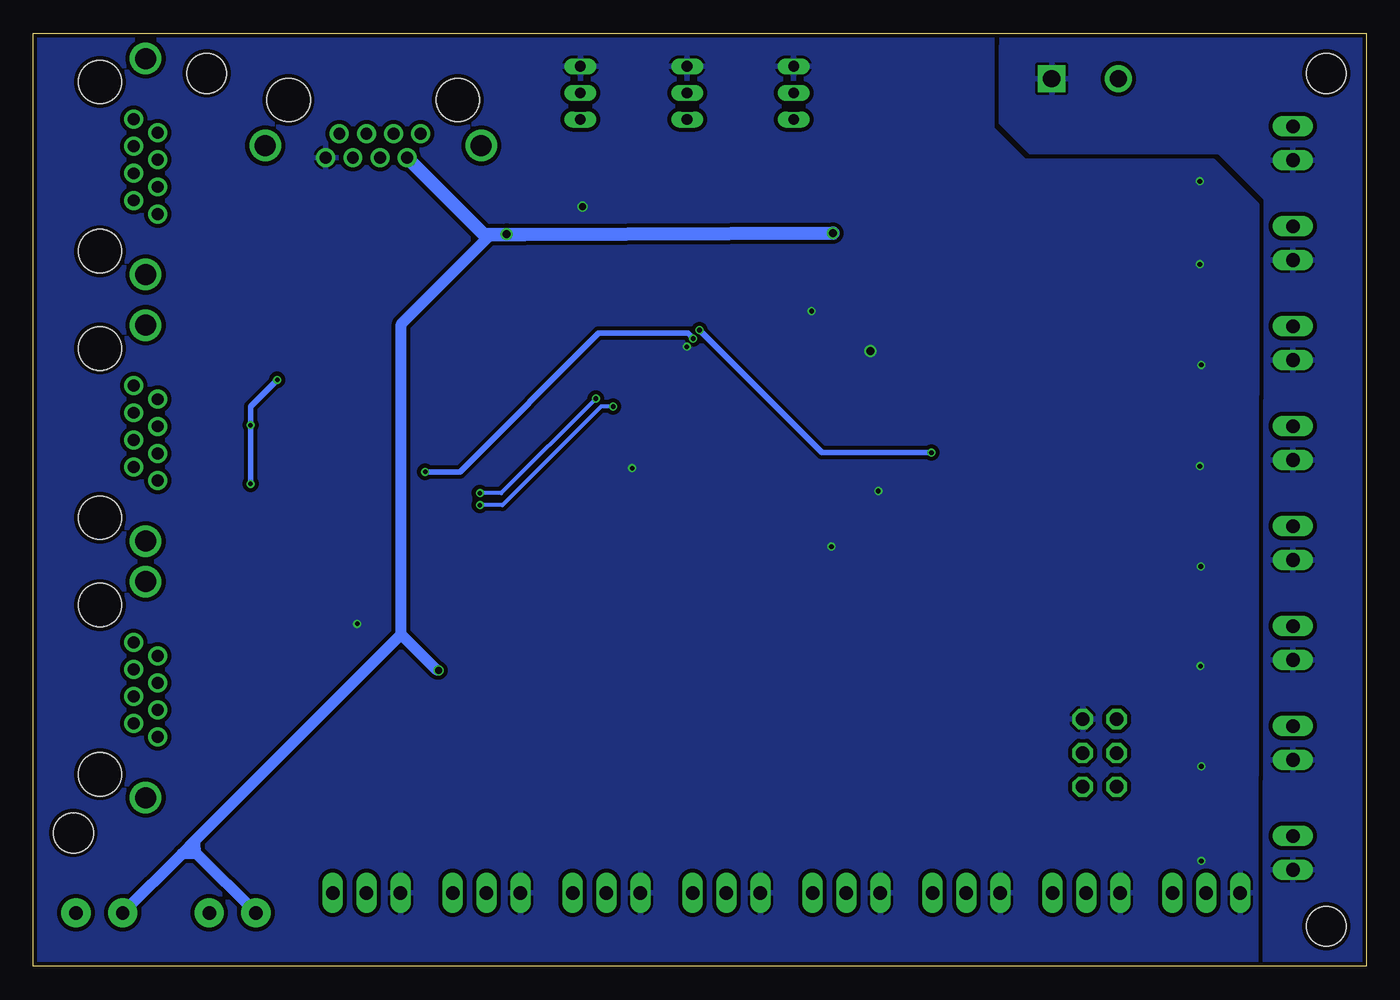
[diagram p7: board, bottom side, seen from below]

Size 100 x 70 mm. Coordinates in mm from the lower left corner, seen from the top.
Outline: 0,0 100,0 100,70 0,70 0,0
Copper layers (1*16): Top 0.018mm / dielectric 1.55mm / Bottom 0.018mm
Design rules "eC_2Layer_PClass6_BaseCopperO18_eCDefault": minimum track width 0.15mm, minimum drill 0.35mm, track to track 0.15mm, track to pad 0.15mm, pad to pad 0.15mm, via to via 0.15mm, smd to smd 0mil, copper to edge 0.25mm, drill to drill 0.35mm, minimum pad ring 0.175mm, minimum via ring 0.125mm, stop-mask expansion 0mil, vias tented up to drill 0.45mm, thermal gap 0.2mm
Holes 3 mm at 3,3 97,10 87,67 3,67

### Footprints (pad centres in the part's own frame; a part is rotated, then mirrored left to right if it is on the bottom)
SCREWTERMINAL-5MM-2 = drill 1.3 pad 2.032 square: 1 0,0 | drill 1.3 pad 2.032: 2 5,0
150CLZ-0810 = smd 3.5 x 2.5: + 3.25,0; - -3.25,0
153CLV-0505 = smd 3 x 1.6: + 2.2,0; - -2.2,0
0805 = smd 0.8 x 1.2: 1 -0.9,0; 2 0.9,0
SOD323_ST = smd 0.8 x 0.6: A 1.25,0; C -1.25,0
1X2-3.5MM = drill 1 pad 2.184: 1 1.8,0; 2 -1.7,0
CHIPLED_0805 = smd 1.2 x 1.2: A 0,-1.05; C 0,1.05
7395-02 = drill 1.016 long: 1 1.27,0; 2 -1.27,0
2X03 = drill 1.016 octagon: 1 -2.54,-1.27; 2 -2.54,1.27; 3 0,-1.27; 4 0,1.27; 5 2.54,-1.27; 6 2.54,1.27
SOT23-3 = smd 0.8 x 0.9: 1 -0.95,-1; 2 0.95,-1; 3 0,1.1
0603-RES = smd 1.1 x 1: 1 -0.85,0; 2 0.85,0
R0805 = smd 1.1 x 1.4: 1 -1,0; 2 1,0
0446200002 = drill 0.889 pad 1.422: 1 3.556,2.54; 2 2.54,4.318; 3 1.524,2.54; 4 0.508,4.318; 5 -0.508,2.54; 6 -1.524,4.318; 7 -2.54,2.54; 8 -3.556,4.318 | drill 1.575 pad 2.286: S@1 -8.103,3.429; S@2 8.103,3.429 | hole 3.251: 6.35,0; -6.35,0
7395-03 = drill 1.016 long: 1 2.54,0; 2 0,0; 3 -2.54,0
SO8 = smd 0.6 x 2.2: 1 -1.905,-2.6; 2 -0.635,-2.6; 3 0.635,-2.6; 4 1.905,-2.6; 5 1.905,2.6; 6 0.635,2.6; 7 -0.635,2.6; 8 -1.905,2.6
JST_B3B-PH_HEADER = drill 0.8 long: P1 2.027,0.048; P2 0.028,0.048; P3 -1.972,0.048
TQFP64_14X14MM_MCU = smd 0.4 x 1.27: 1 -6,-7.6; 2 -5.2,-7.6; 3 -4.4,-7.6; 4 -3.6,-7.6; 5 -2.8,-7.6; 6 -2,-7.6; 7 -1.2,-7.6; 8 -0.4,-7.6; 9 0.4,-7.6; 10 1.2,-7.6; 11 2,-7.6; 12 2.8,-7.6; 13 3.6,-7.6; 14 4.4,-7.6; 15 5.2,-7.6; 16 6,-7.6; 33 6,7.6; 34 5.2,7.6; 35 4.4,7.6; 36 3.6,7.6; 37 2.8,7.6; 38 2,7.6; 39 1.2,7.6; 40 0.4,7.6; 41 -0.4,7.6; 42 -1.2,7.6; 43 -2,7.6; 44 -2.8,7.6; 45 -3.6,7.6; 46 -4.4,7.6; 47 -5.2,7.6; 48 -6,7.6 | smd 1.27 x 0.4: 17 7.6,-6; 18 7.6,-5.2; 19 7.6,-4.4; 20 7.6,-3.6; 21 7.6,-2.8; 22 7.6,-2; 23 7.6,-1.2; 24 7.6,-0.4; 25 7.6,0.4; 26 7.6,1.2; 27 7.6,2; 28 7.6,2.8; 29 7.6,3.6; 30 7.6,4.4; 31 7.6,5.2; 32 7.6,6; 49 -7.6,6; 50 -7.6,5.2; 51 -7.6,4.4; 52 -7.6,3.6; 53 -7.6,2.8; 54 -7.6,2; 55 -7.6,1.2; 56 -7.6,0.4; 57 -7.6,-0.4; 58 -7.6,-1.2; 59 -7.6,-2; 60 -7.6,-2.8; 61 -7.6,-3.6; 62 -7.6,-4.4; 63 -7.6,-5.2; 64 -7.6,-6
SOT230P700X180-4N = smd 1.626 x 0.889: 1 -3.2,2.311; 2 -3.2,0; 3 -3.2,-2.311 | smd 1.626 x 3.175: 4 3.2,0
SOIC127P600X175-16N = smd 2.057 x 0.61: 1 -4.801,8.89; 2 -4.801,7.62; 3 -4.801,6.35; 4 -4.801,5.08; 5 -4.801,3.81; 6 -4.801,2.54; 7 -4.801,1.27; 8 -4.801,0; 9 0,0; 10 0,1.27; 11 0,2.54; 12 0,3.81; 13 0,5.08; 14 0,6.35; 15 0,7.62; 16 0,8.89
SOP65P640X120-20N = smd 1.473 x 0.356: 1 -2.921,2.921; 2 -2.921,2.286; 3 -2.921,1.626; 4 -2.921,0.965; 5 -2.921,0.33; 6 -2.921,-0.33; 7 -2.921,-0.965; 8 -2.921,-1.626; 9 -2.921,-2.286; 10 -2.921,-2.921; 11 2.921,-2.921; 12 2.921,-2.286; 13 2.921,-1.626; 14 2.921,-0.965; 15 2.921,-0.33; 16 2.921,0.33; 17 2.921,0.965; 18 2.921,1.626; 19 2.921,2.286; 20 2.921,2.921
SSOP24 = smd 0.348 x 1.397: 1 -3.575,-3.656; 2 -2.925,-3.656; 3 -2.275,-3.656; 4 -1.625,-3.656; 5 -0.975,-3.656; 6 -0.325,-3.656; 7 0.325,-3.656; 8 0.975,-3.656; 9 1.625,-3.656; 10 2.275,-3.656; 11 2.925,-3.656; 12 3.575,-3.656; 13 3.575,3.656; 14 2.925,3.656; 15 2.275,3.656; 16 1.625,3.656; 17 0.975,3.656; 18 0.325,3.656; 19 -0.325,3.656; 20 -0.975,3.656; 21 -1.625,3.656; 22 -2.275,3.656; 23 -2.925,3.656; 24 -3.575,3.656

### Placement (x,y rotation side)
12V  23.6,66.6 180 top
C1  33,65.5 180 top
C2  33,56 180 top
C3  79.16,28.93 0 top
C4  30.75,48 270 top
C5  24.5,48 270 top
C6  10,66.9 90 top
C7  82.3,34.4 180 top
C8  78.9,43.7 180 top
C9  35.48,46.94 90 top
C10  39.4,48.8 180 top
C11  53.3,47.2 0 top
C12  68.7,19.9 270 top
C13  18.9,61.2 0 top
C14  73.62,29.4 90 top
C15  13.68,43.6 180 top
D1  90.25,5 90 top
D2  80.25,5 90 top
FAN_1  95,4 0 top
FAN_2  85,4 0 top
LED1  18.4,23.2 180 top
LED2  21.3,23.2 180 top
LED3  24.3,23.2 180 top
MOTOR1  5.5,8.5 270 top
MOTOR2  5.5,16.75 270 top
MOTOR3  5.5,24.25 270 top
MOTOR4  5.5,31.75 270 top
MOTOR5  5.5,39.25 270 top
MOTOR6  5.5,46.75 270 top
MOTOR7  5.5,54.25 270 top
MOTOR8  5.5,61.75 270 top
PDI  20,16 270 top
Q1  9.48,47.48 90 top
Q2  9.48,32.48 90 top
Q3  9.48,17.48 90 top
Q4  9.48,61.08 90 top
Q5  9.48,54.98 90 top
Q6  9.48,39.98 90 top
Q7  9.48,24.98 90 top
Q8  9.48,9.98 90 top
Q9  78.2,35.7 270 top
Q10  78.3,40.15 270 top
Q11  61.3,58.5 90 top
Q12  61,50 180 top
R1  12.48,61.08 90 top
R2  12.48,47.48 90 top
R3  9.48,50.48 0 top
R4  12.48,32.48 90 top
R5  9.28,63.88 180 top
R6  9.48,35.48 0 top
R7  12.48,17.48 90 top
R8  9.48,20.48 0 top
R9  12.48,54.98 90 top
R10  9.48,57.98 0 top
R11  12.48,39.98 90 top
R12  9.48,42.98 0 top
R13  12.48,24.98 90 top
R14  9.48,27.98 0 top
R15  12.48,9.98 90 top
R16  9.48,12.98 0 top
R17  75.1,35.9 270 top
R18  81.2,37.5 180 top
R19  75.12,40.1 270 top
R20  82.4,39.65 180 top
R21  18.4,29.55 90 top
R22  21.3,29.55 90 top
R23  47,66 270 top
R24  55,66 270 top
R25  63,66 270 top
R26  64.45,58.4 90 top
R27  61,55.5 0 top
R28  61,52.8 180 top
R29  64.35,52.3 270 top
R30  24.3,29.6 90 top
R31  71.9,15.1 0 top
R32  71.9,13 0 top
RJ45_BLUE  95,20.75 90 top
RJ45_COMM  74.5,65 180 top
RJ45_RED  95,60 90 top
RJ45_WHITE  95,40 90 top
SENSOR1  12,5.5 0 top
SENSOR2  21,5.5 0 top
SENSOR3  30,5.5 0 top
SENSOR4  39,5.5 0 top
SENSOR5  48,5.5 0 top
SENSOR6  57,5.5 0 top
SENSOR7  66,5.5 0 top
SENSOR8  75,5.5 0 top
T1  79,12.5 270 top
TEMP_1  43,65.5 90 top
TEMP_2  51,65.5 90 top
TEMP_3  59,65.5 90 top
U1  45,40 45 top
U3  20.2,55.5 270 top
U4  25,42 90 top
U6  79,48.5 0 top
U7  79,21.75 0 top
U8  64,21.75 90 top
U9  67.5,35.3 180 top

### Tracks (layer width: path | path; a pad name or v marks a point on that pad's centre or on a via)
+5V  (via drill 0.35)
  Top 0.305: U7.19 81,24.04 | 80.96,24.04 80.7,24.04 | 80.7,24.04 80.36,24.04 80.3,24.1 | 81,24.04 80.96,24.04 | 80.96,24.04 80.3,24.7 | 81,24.04 80.7,23.74 | 80.7,23.74 80.36,23.4 80.3,23.4 | 80.7,24.04 80.7,23.74 | v83.7,40.6 83.7,40.1 R20.1
  Top 0.406: C3.+ 83.6,31.17 83.6,34.5 84.15,35.05 | 84.15,35.05 84.55,35.45 | 84.55,35.45 87.58,38.48 RJ45_WHITE.6 91.44,38.48 RJ45_WHITE.5 | C7.1 83.7,34.95 | 83.7,34.95 83.8,35.05 84.15,35.05 | 83.7,35.9 v83.7,36.2 83.35,36.2 | 83.7,35.9 83.7,35.6 83.7,35.5 | 83.7,35.5 83.7,34.95 | 83.7,35.5 84.15,35.05 | 83.7,35.9 84.15,35.45 84.55,35.45 | U6.19 81.09,50.79 80.6,50.3 80.6,45.1 | 81.6,44 v81.7,44 | 80.6,45.1 80.95,44.75 | 80.95,44.75 81.35,44.35 | 81.35,44.35 81.6,44.1 81.6,44 | 80.6,45.1 80.6,44.55 80.4,44.35 | 80.4,44.35 C8.1 80.05,44 81.6,44 | 81.35,44.35 80.7,44.35 | 80.7,44.35 80.4,44.35 | 80.95,44.75 80.7,44.5 80.7,44.35 | 83.35,36.2 R18.1 | 83.45,35.35 83.45,36.1 83.35,36.2
  Top 0.508: C7.1 83.15,35.05 83.45,35.35 83.7,35.6
  Top 0.61: C3.+ 80.3,27.87 80.3,24.7 80.3,24.1 80.3,23.4 80.3,18.7 79,17.3 67,17.3 66.31,18.29 U8.3
  Bottom 0.305: v83.7,40.6 83.7,41.3
  Bottom 0.406: v83.7,36.2 83.7,41.3 83.7,42 v81.7,44
+12V  (via drill 0.5, 0.6)
  Top 0.406: 10,65.6 C6.1 10.12,65.88 10.12,65.47 | C13.1 17.89,61.09 17.89,59.5 | 64.45,56.8 R26.1 63.7,57.55 | 64.45,56.8 64.45,54.8 | 64.45,54.8 64.45,53.25 R29.1 | v64.48,54.95 64.48,54.83 64.45,54.8 | 63.7,57.55 Q11.1 | 64.45,56.8 63.7,57.55
  Top 0.813: 2,59.2 2,62.4 5.2,65.6 9.03,65.6 | 2,59.2 2,58 | 2,58 2,56.9 | 2,56.9 2,51.8 | 2,51.8 2,50.5 | 2,50.5 2,49.27 | 2,49.27 2,44 | 2,44 2,42.9 | 2,42.9 2,41.9 | 2,41.9 2,36.75 | 2,36.75 2,35.3 | 2,35.3 2,34.2 | 2,34.2 2,29.2 | 2,29.2 2,28 | 2,28 2,26.8 | 2,26.8 2,21.77 | 2,21.77 2,20.5 | 2,20.5 2,19.2 | 2,19.2 2,15.1 4.12,12.97 R16.1 | 11.22,65.6 10,65.6 | 10,65.6 9.03,65.6 | R5.1 10.12,64.5 | 10.12,64.5 10.12,65.47 10,65.6 | 9.03,65.6 10.12,64.5 | 11.22,65.6 10.12,64.5 | R10.1 3.23,57.98 | 3.08,57.98 2.02,57.98 2,58 | 2,59.2 3.23,57.98 | 2,56.9 3.08,57.98 | 3.08,57.98 3.23,57.98 | R3.1 3.2,50.48 | 3.2,50.48 2.02,50.48 2,50.5 | 2,51.8 3.2,50.6 3.2,50.48 | 2,49.27 3.2,50.48 | R12.1 3.08,42.98 | 3.02,42.98 2.08,42.98 2,42.9 | 2,44 3.02,42.98 | 3.02,42.98 3.08,42.98 | 2,41.9 3.08,42.98 | R6.1 3.27,35.48 | 3.27,35.48 2.17,35.48 2,35.3 | 2,34.2 3.27,35.48 | 3.27,35.48 2,36.75 | R14.1 8.6,28 3.2,28 | 3.2,28 2,28 | R8.1 3.3,20.48 | 3.3,20.48 2.02,20.48 2,20.5 | 3.3,20.48 2,21.77 | 3.3,20.48 2.02,19.2 2,19.2 | 3.2,28 2,29.2 | 3.2,28 2,26.8 | 11.22,65.6 16.6,65.6 | 16.6,65.6 17.2,65.6 | 17.2,65.6 17.6,65.6 17.89,65.89 | 16.6,65.6 17.89,64.31 17.89,64.3 | 17.2,65.6 18.2,66.6 12V.2 | FAN_2.2 83.05,3.75 D2.C | FAN_1.2 93.05,3.75 D1.C | v69.6,22.2 68.7,21.3 | 68.7,21.3 68.2,20.8 63.94,20.8 U8.1 | C12.1 68.7,21.3
  Top 1.016: 12V.2 17.89,65.89 | 17.89,65.89 17.89,64.9 | 17.89,64.9 17.89,64.3 17.89,59.5 U3.3 | 17.89,64.9 18.29,64.5 19.5,64.5 | 29.3,63.8 28.6,64.5 19.5,64.5 | 29.3,63.8 29.7,63.4 | 29.7,63.4 29.7,56.05 C2.+ 32.35,53.4 38.4,53.4 v40,55 | 19.5,64.5 18.11,65.89 17.89,65.89 | 29.7,63.4 31,64.7 31,65.4 29.85,65.4 C1.+ 29.75,64.25 29.3,63.8
  Bottom 0.406: 66.78,55.5 67.14,55.86 | v64.48,54.95 63.24,54.95 63.2,54.91 | v69.6,22.2 69.7,22.2
  Bottom 0.813: 65.7,54.9 72.4,48.2 72.4,24.9 | 69.7,22.2 72.4,24.9 | 72.4,24.9 87.85,9.45 | 87.85,9.45 88.85,8.45 | 88.85,8.45 FAN_1.2 | FAN_2.2 87.75,8.45 88.2,8.45 | 88.2,8.45 88.85,8.45 | 88.2,8.45 87.85,8.8 87.85,9.45
  Bottom 1.016: v40,55 63.2,54.91 65.7,54.9 66.18,54.9 67.14,55.86 RJ45_COMM.2
A
  Top 0.406: U1.48 34.53,41.13 32.8,39.4 23.3,39.4 22.46,40.24 U4.11
B
  Top 0.406: U1.47 35.55,42.1 34.4,42.1 32.5,40.2 24.4,40.2 23.73,40.87 U4.10
C
  Top 0.406: U1.46 35.88,42.9 34.1,42.9 32.2,41 25.6,41 25,41.6 U4.9
FAN_ROW_1_PWM
  Top 0.406: 54.78,41.3 U1.17 54.62,40.08 59.6,35.1 59.6,17.3 63.1,13.8 69.75,13.8 R31.1
FAN_ROW_2_PWM
  Top 0.406: U1.16 58.8,34.69 58.8,17 62.8,13 R32.1
GND
  Top 0.406: U1.44 38.8,42.24 38.8,38.77 38.68,38.77 U1.52 | U1.14 53.48,37.76 52.6,38.65 47.61,38.65 U1.60 41.16,32.2 39.6,32.2 | U1.34 47.96,44.4 49.96,44.4 U1.24 51.57,46 53.5,46 54.2,46.7 C11.2 | U9.12 63.92,37.98 65.22,36.67 U9.15 65.22,29.02 65.1,28.9 | C8.2 78.05,45.15 78.6,45.7
  pour Top (isolate 0.406): 45.01,49.26 54.09,40.18 54.09,39.75 45.25,30.91 44.81,30.91 35.93,39.8 35.93,40.19 45,49.26 45,49.29
  pour Top (isolate 0.305, rank 2): 0.1,70 100.1,70 100.1,0 0.1,0
  pour Bottom (isolate 0.305, rank 2): 27.32,69.66 27.56,63.1 25.44,60.94 11.32,60.96 8.16,57.64 7.94,0 -0.02,0.06 0.08,69.94
IR_1
  Top 0.406: SENSOR1.1 19.54,10.5 21.72,10.5 U1.62
IR_2
  Top 0.406: U1.63 43.25,30.95 23.54,11.24 SENSOR2.1
IR_3
  Top 0.406: SENSOR3.1 32.54,19.14 43.78,30.38 U1.64
IR_4
  Top 0.406: SENSOR4.1 46.8,10.76 46.8,29.71 U1.1
IR_5
  Top 0.406: SENSOR5.1 50.54,7.76 47.6,10.7 47.6,30.05 U1.2
IR_6
  Top 0.406: SENSOR6.1 55.44,9.6 51.4,9.6 48.4,12.6 48.4,30.38 U1.3
IR_7
  Top 0.406: SENSOR7.1 63.64,10.4 51.8,10.4 49.2,13 49.2,30.71 U1.4
IR_8
  Top 0.406: SENSOR8.1 71.84,11.2 52.1,11.2 50,13.3 50,31.04 U1.5
LED_1
  Top 0.406: U1.49 31.91,35.4 23,35.4 18.4,30.8 R21.2
LED_2
  Top 0.406: U1.50 32.25,34.6 25.35,34.6 R22.2
LED_3
  Top 0.406: R30.2 27.5,33.8 35.97,33.8 U1.54
MOTOR_1
  Top 0.508: 8.38,10.6 Q8.3 8.33,9.93 7.9,9.93 | 8.38,10.6 8.38,11.03 | 8.38,11.03 R16.2 | MOTOR1.2 5.66,9.93 7.28,9.93 | 7.28,9.93 7.9,9.93 | 8.38,11.03 7.28,9.93 | 8.38,10.6 7.9,10.12 7.9,9.93
MOTOR_2
  Top 0.508: 8.33,17.43 Q3.3 | Q3.3 8.38,18.52 | 8.38,18.52 R8.2 | MOTOR2.2 7.83,18.02 | 7.83,18.02 Q3.3 | 8.38,18.52 7.87,18.02 7.83,18.02
MOTOR_3
  Top 0.508: 8.38,26.02 Q7.3 8.33,24.93 7.88,25.38 | 8.38,26.02 R14.2 | MOTOR3.2 7.74,25.52 7.88,25.38 | 8.38,26.02 7.88,25.53 7.88,25.38
MOTOR_4
  Top 0.508: 8.38,33.52 Q2.3 8.33,32.43 7.93,32.83 | 8.38,33.52 R6.2 | MOTOR4.2 7.74,33.02 7.93,32.83 | 8.38,33.52 7.93,33.08 7.93,32.83
MOTOR_5
  Top 0.508: 8.38,41.02 Q6.3 7.83,40.52 | 8.38,41.02 R12.2 | MOTOR5.2 7.83,40.52 | 8.38,41.02 7.87,40.52 7.83,40.52
MOTOR_6
  Top 0.508: 8.38,48.52 Q1.3 8.33,47.43 7.74,48.02 | 8.38,48.52 R3.2 | MOTOR6.2 7.74,48.02 | 8.38,48.52 7.87,48.02 7.74,48.02
MOTOR_7
  Top 0.508: 8.38,56.02 Q5.3 8.33,54.93 7.8,54.93 | 8.38,56.02 R10.2 | MOTOR7.2 6.09,54.93 7.28,54.93 | 7.28,54.93 7.8,54.93 | 8.38,56.02 8.12,55.77 | 8.12,55.77 7.28,54.93 | 8.12,55.77 8.12,55.25 7.8,54.93
MOTOR_8
  Top 0.508: 8.33,61.03 Q4.3 8.38,62.45 | 8.38,62.45 8.38,63 | 8.38,63 8.38,63.59 | R5.2 8.38,63.83 8.38,63.59 | MOTOR8.2 7.8,63.02 | 7.8,63.02 8.36,63.02 8.38,63 | 7.8,63.02 8.38,62.45 | 7.8,63.02 8.38,63.59
MOTOR_LEVEL_1
  Top 0.406: R15.2 15.6,13.95 15.6,30.9 21.19,36.49 U4.5
  Top 0.508: Q8.2 12.38,10.93 R15.2
MOTOR_LEVEL_2
  Top 0.406: R7.2 14.6,20.45 14.6,31.1 19.92,36.42 U4.4
  Top 0.508: Q3.2 12.38,18.43 R7.2
MOTOR_LEVEL_3
  Top 0.406: R13.2 13.7,27.05 13.7,32.5 17.38,36.18 U4.2
  Top 0.508: Q7.2 12.38,25.93 R13.2
MOTOR_LEVEL_4
  Top 0.406: R4.2 16.11,36.96 U4.1
  Top 0.508: Q2.2 12.38,33.42 R4.2
MOTOR_LEVEL_5
  Top 0.406: U4.15 17.38,40.78 16.7,40.1 13.2,40.1 R11.2
  Top 0.508: Q6.2 12.38,40.92 R11.2
MOTOR_LEVEL_6
  Top 0.406: R2.2 13.47,48.33 18.7,43.1 18.65,43.05 U4.14
  Top 0.508: Q1.2 12.38,48.42 R2.2
MOTOR_LEVEL_7
  Top 0.406: R9.2 15,53.3 15,47.9 19.92,42.98 U4.13
  Top 0.508: Q5.2 12.38,55.92 R9.2
MOTOR_LEVEL_8
  Top 0.406: 13.9,60.5 15.9,58.5 15.9,48.2 21.19,42.91 U4.12
  Top 0.508: Q4.2 10.57,61.92 R1.2 | 12.74,61.92 R1.2 | R1.2 13.9,60.5
MOTOR_PWM  (via drill 0.35)
  Top 0.406: v50.02,47.73 49.91,47.73 U1.27 | U4.3 18.65,37.85 19.4,38.6 32.55,38.6 v32.62,38.53
  Bottom 0.406: v32.62,38.53 40.82,38.53 v50.02,47.73
N$1
  Top 0.406: LED2.A R22.1
N$2
  Top 0.406: T1.2 75.11,13.13 73.15,15.1 R31.2
N$3
  Top 0.406: R21.1 LED1.A
N$4
  Top 0.406: R30.1 LED3.A
N$5
  Top 0.508: T1.5 81.6,11.2
  Top 0.813: T1.6 81.6,11.2 81.6,9.2 | 81.6,9.2 FAN_2.1 | D2.A 80.25,7.85 81.6,9.2 | T1.6 80.8,11.87 80.8,10.7 82.3,10.7 | T1.5 82.3,10.6 82.3,11.87 T1.6
N$6
  Top 0.406: R32.2 72.75,12.85 75,10.6 T1.4
N$7
  Top 0.305: T1.7 81.56,13.1 80.8,13.1
  Top 0.813: T1.8 82.3,13.7 | 82.3,13.7 89.75,6.25 D1.A 94.55,6.25 FAN_1.1 | 82.3,13.7 80.8,13.7 80.8,13.8 | T1.8 80.8,14.4 80.8,13.1 82.5,13.1 82.5,14.4 T1.8
PDI_DATA
  Top 0.406: U1.56 33.1,28.67 33.1,24.1 26.4,17.4 19.8,17.4 18.73,18.47 PDI.1
RESET_PDI_CLK
  Top 0.406: U1.57 34,28.43 34,23.9 24.8,14.7 20.1,14.7 18.86,13.46 PDI.5
RX
  Top 0.406: U1.28 51.24,50.2 59.5,50.2 62.5,50.2 63,50.7 63,54.35 R27.2 60.2,57.15 Q11.3
RX_ATXMEGA
  Top 0.406: RJ45_COMM.4 73.99,60.59 72.65,59.25 R26.2 64.25,59.45 Q11.2
S0
  Top 0.305: U1.23 52,45.3 60.4,45.3 65.22,40.48 U9.10
S1
  Top 0.305: U1.22 52.43,44.6 60.1,44.6 64.58,40.12 U9.11
S2
  Top 0.305: 52.86,43.9 U1.21 52.96,44 59.1,44 63,40.1 63,38 64.58,36.42 U9.14
S3
  Top 0.305: 53.29,43.2 U1.20 53.49,43.4 58.8,43.4 62.3,39.9 62.3,37.8 63.92,36.17 U9.13
TEMP_1
  Top 0.406: U1.32 46.8,50.28 46.8,64.5 46.45,64.85 | 46.45,64.85 45.8,65.5 42.98,65.5 TEMP_1.P2 | R23.2 46.6,65 46.45,64.85
TEMP_2
  Top 0.406: U1.31 47.6,49.95 47.6,62.8 50.33,65.53 TEMP_2.P2 54.47,65.53 R24.2
TEMP_3
  Top 0.406: U1.30 48.4,49.62 48.4,60.7 49.9,62.2 55.62,62.2 TEMP_3.P2 62.47,65.53 R25.2
TRIGGER_1
  Top 0.305: RJ45_WHITE.3 82.42,41.52 81.05,40.15
  Top 0.406: R20.2 81.05,40.15 Q10.3
TRIGGER_2
  Top 0.305: R18.2 81.45,38.6 86.7,38.6 87.3,39.2 89.37,39.2 RJ45_WHITE.4
  Top 0.406: Q9.3 79.3,36.45 R18.2
  Top 0.508: Q9.3 79.3,35.95
TX
  Top 0.406: U1.29 50.91,51 59.25,51 | 59.25,51 Q12.2 60.05,51.8 | R28.2 60.05,52.7 60.05,51.8 | 60.05,51.8 59.25,51
TX_ATXMEGA
  Top 0.406: Q12.3 61.6,49.5 62.8,49.5 64.35,51.05 R29.2 65.4,52.5 65.4,56 67.8,58.4 73.74,58.4 RJ45_COMM.6
ULTRA1
  Top 0.305: U9.9 65.88,43.27 74.02,51.42 U6.1
ULTRA2
  Top 0.305: U9.8 66.53,43.02 73.63,50.13 U6.3
ULTRA3
  Top 0.305: U9.7 67.17,42.67 73.97,49.47 U6.4
ULTRA4
  Top 0.305: U9.6 67.83,42.42 74.23,48.83 U6.5
ULTRA5
  Top 0.305: U9.5 68.47,42.17 74.47,48.17 U6.6
ULTRA6
  Top 0.305: U9.4 69.12,41.92 74.73,47.53 U6.7
ULTRA7
  Top 0.305: U9.3 69.78,41.67 74.97,46.87 U6.8
ULTRA8
  Top 0.305: U9.2 70.42,41.42 75.21,46.21 U6.9
ULTRA9
  Top 0.305: U9.23 70.42,29.77 75.53,24.67 U7.1
ULTRA10
  Top 0.305: U9.22 69.78,28.73 75.12,23.38 U7.3
ULTRA11
  Top 0.305: U9.21 69.12,28.48 74.9,22.7 76.06,22.7 U7.4
ULTRA12
  Top 0.305: U9.20 68.47,28.12 74.52,22.08 U7.5
ULTRA13
  Top 0.305: U9.19 67.83,27.88 74.28,21.42 U7.6
ULTRA14
  Top 0.305: U9.18 67.17,27.62 74.02,20.79 U7.7
ULTRA15
  Top 0.305: U9.17 66.53,27.38 73.78,20.12 U7.8
ULTRA16
  Top 0.305: U9.16 65.88,27.23 73.64,19.46 U7.9
ULTRA_COM  (via drill 0.35)
  Top 0.406: U1.26 50.4,47.1 v50.5,47.1 | v70.6,37.1 71.08,37.58 U9.1
  Bottom 0.406: v50.5,47.1 50.9,47.5 57.6,47.5 68,37.1 v70.6,37.1
ULTRA_TRIGGER_1  (via drill 0.35)
  Top 0.305: U1.19 53.82,42.6 56.25,42.6 56.75,42.6 v57.8,42.6
  Top 0.508: v66.5,35.5 71.37,35.5 R19.2 75.17,39.2 Q10.2
  Bottom 0.305: v57.8,42.6 64.9,35.5 v66.5,35.5
ULTRA_TRIGGER_2  (via drill 0.35)
  Top 0.305: U1.18 54.38,42.02 56.48,42.02 v56.5,42
  Top 0.508: v66.5,34.6 75.1,34.6 | 75.1,34.6 77.05,34.6 Q9.2 | R17.2 75.1,34.6
  Bottom 0.305: v56.5,42 57.4,42 64.8,34.6 v66.5,34.6
ULTRAS1
  Top 0.305: U6.20 82.22,51.42 85.5,54.7 85.5,59.3 88.74,62.54 RJ45_RED.2
ULTRAS2
  Top 0.305: U6.18 83.03,50.13 86.3,53.4 86.3,58.9 88.92,61.52 RJ45_RED.3
ULTRAS3
  Top 0.305: U6.17 83.27,49.47 87,53.2 87,58.5 89.01,60.51 RJ45_RED.4
ULTRAS4
  Top 0.305: U6.16 83.63,48.83 87.7,52.9 87.7,57.8 89.39,59.49 RJ45_RED.5
ULTRAS5
  Top 0.305: U6.15 83.97,48.17 88.4,52.6 88.4,57 89.88,58.48 RJ45_RED.6
ULTRAS6
  Top 0.305: U6.14 84.33,47.53 89.1,52.3 89.1,56.3 90.27,57.46 RJ45_RED.7
ULTRAS7
  Top 0.305: U6.13 85.03,46.87 88.34,43.56 RJ45_WHITE.1
ULTRAS8
  Top 0.305: U6.12 84.69,46.21 88.36,42.54 RJ45_WHITE.2
ULTRAS9
  Top 0.305: U7.20 84.4,27.15 84.4,34.1 87.76,37.46 RJ45_WHITE.7
ULTRAS10
  Top 0.305: U7.18 82.88,23.38 85.1,25.6 85.1,33.7 87.84,36.44 RJ45_WHITE.8
ULTRAS11
  Top 0.305: RJ45_BLUE.2 83.69,23.29 83.11,22.71 U7.17
ULTRAS12
  Top 0.305: U7.16 83.38,22.08 83.57,22.27 RJ45_BLUE.3
ULTRAS13
  Top 0.305: U7.15 90.52,21.42 RJ45_BLUE.4
ULTRAS14
  Top 0.305: RJ45_BLUE.5 85.06,20.24 84.52,20.79 U7.14
ULTRAS15
  Top 0.305: U7.13 84.28,20.12 85.17,19.23 RJ45_BLUE.6
ULTRAS16
  Top 0.305: RJ45_BLUE.7 85.29,18.21 84.04,19.46 U7.12
VCC  (via drill 0.35, 0.5, 0.6)
  Top 0.305: v75.7,25.7 75.15,26.25
  Top 0.406: U1.15 54.99,37.37 v55.06,37.37 | U1.25 50.91,46.48 v50.97,46.48 51.69,47.2 C11.1 | U1.53 36.7,35.66 v36.6,35.66 | U7.10 77.23,18.83 77.6,19.2 77.6,23.5 | 77.6,24 77.6,24.7 77.45,24.85 | 77.6,24 77.6,23.5 | U9.24 71.08,30.32 73.62,27.78 | 74.01,27.39 75.15,26.25 75.8,25.6 76.7,25.6 77.45,24.85 | U7.2 77,24.04 | 77,24.04 77.56,24.04 77.6,24 | 77,24.04 77.45,24.49 77.45,24.85 | 77,24.04 77.54,23.5 77.6,23.5 | U4.16 16.11,42.79 15.79,43.11 | 13.79,45.11 v12.37,45.11 | 15.79,43.11 15.3,43.6 | 15.3,43.6 14.31,44.59 | 14.31,44.59 13.79,45.11 | 13.79,45.11 13.4,45.5 | 13.4,45.5 13.15,45.75 | 13.15,45.75 12.47,46.42 R2.1 12.7,46.4 12.7,45.4 | 13.15,45.75 12.8,45.4 12.7,45.4 | 12.7,45.4 12.37,45.4 | 12.37,45.6 12.47,45.5 13.4,45.5 | U1.45 35.9,44.01 35.9,45.1 | 35,46 34.9,46 | v40.12,31.48 41.57,31.48 U1.61 | U1.35 42.06,49.16 v41.6,49.16 40.66,49.16 C10.1 | 35.8,46.09 35.9,45.99 35.9,45.1 | 35.9,45.1 36.5,45.7 36.5,46.09 | 35.9,45.1 35,46 | C9.1 35.04,46.04 35,46 | R24.1 54.47,67.53 TEMP_2.P1 | R23.1 46.47,67.53 TEMP_1.P1 | TEMP_3.P1 62.47,67.53 R25.1 | Q12.1 61.95,52.7 R28.1 61.85,53.8 R27.1 60.15,55.65 v58.8,57 | 73.62,27.78 C14.1 74.01,28.11 74.01,27.39 | 73.62,27.78 74.01,27.39 | 14.62,43.6 C15.1 14.31,43.87 14.31,44.59 | 14.62,43.6 15.3,43.6 | 15.79,43.11 15.11,43.11 14.95,43.27 | 14.95,43.27 14.62,43.6 | 15.3,43.6 14.97,43.27 14.95,43.27
  Top 0.508: U6.2 77.09,50.79 | 77.09,50.79 77.65,51.35 | RJ45_COMM.8 78.1,60.64 78.1,51.8 77.65,51.35 | U6.10 76.13,45.63 76.98,45.63 | 76.98,45.63 78.1,46.75 78.1,49.77 77.59,50.29 | 77.09,50.79 77.59,50.29 | 77.65,51.35 77.65,50.35 77.59,50.29 | 76.98,45.63 76.98,41.9 | 76.98,41.9 76.98,41.42 Q10.1 | Q10.1 76.18,41.1 | 76.18,41.1 75.27,41.1 R19.1 | 76.98,41.9 76.18,41.1 | R17.1 75.2,36.65 Q9.1 77.75,36.65 78.4,37.3 78.4,40.4 77.7,41.1 Q10.1
  Top 0.61: v12.37,15 12.37,16.52 | 12.37,16.52 R7.1 | Q3.1 12.36,16.52 12.37,16.52 | v12.43,22.52 12.43,24.08 R13.1 12.38,24.02 Q7.1 | v12.41,29.99 12.41,31.56 | 12.41,31.56 R4.1 | Q2.1 12.38,31.52 12.41,31.56 | v12.48,37.52 12.48,39.12 | 12.48,39.12 R11.1 | Q6.1 12.39,39.02 12.48,39.12 | v12.37,45.11 12.37,45.4 12.37,45.6 12.37,46.52 | 12.37,46.52 R2.1 | R2.1 | Q1.1 12.36,46.52 12.37,46.52 | v12.47,52.67 R9.1 12.38,54.02 Q5.1 | v12.47,58.89 R1.1 12.38,60.12 Q4.1 | v12.37,7.9 12.37,9.02 R15.1 12.38,9.03 Q8.1
  Top 1.016: v37.2,46.16 37.13,46.09 36.5,46.09 35.8,46.09 31.04,46.09 C4.+ 30.45,46.1 24.2,46.1 | 24.1,46.1 24.2,46.1 | 24.2,46.1 C5.+ 20.2,50.1 U3.4 U3.2
  pour Bottom (isolate 0.305): 28.1,70 65.9,69.8 81.4,69.9 100,69.9 100,0 8.3,0 8.2,57.1 11.5,60.4 25.7,60.4 28.1,62.8

### Text on the board
tPlace: + | +12V | Raspberry | Red | White | Blue
tNames: Glen te Hofsté | Control PCB V2.0 | Group: 3S_1718_8.62 | Before use check the manual! | + | +